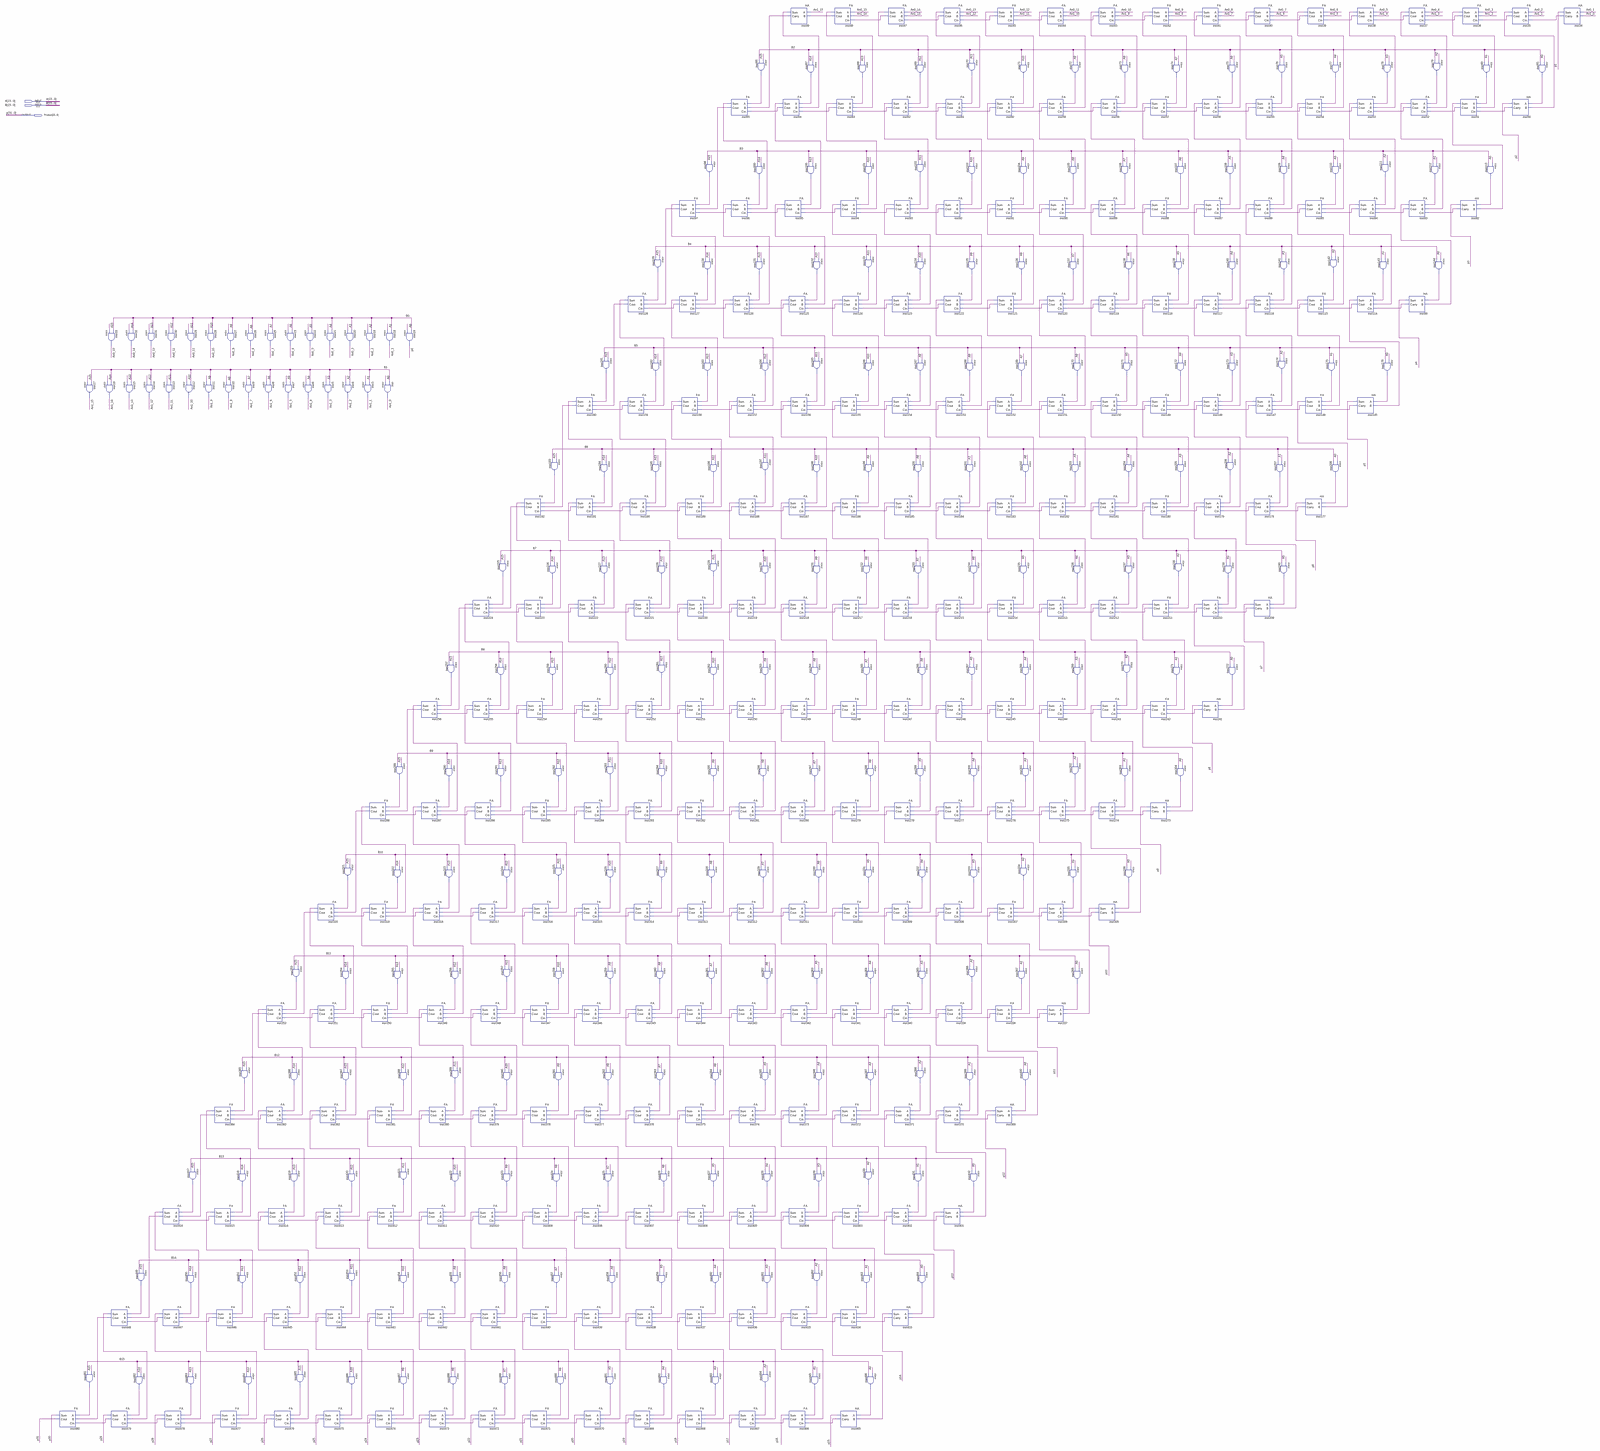
[diagram p0: schematic sheet, whole]
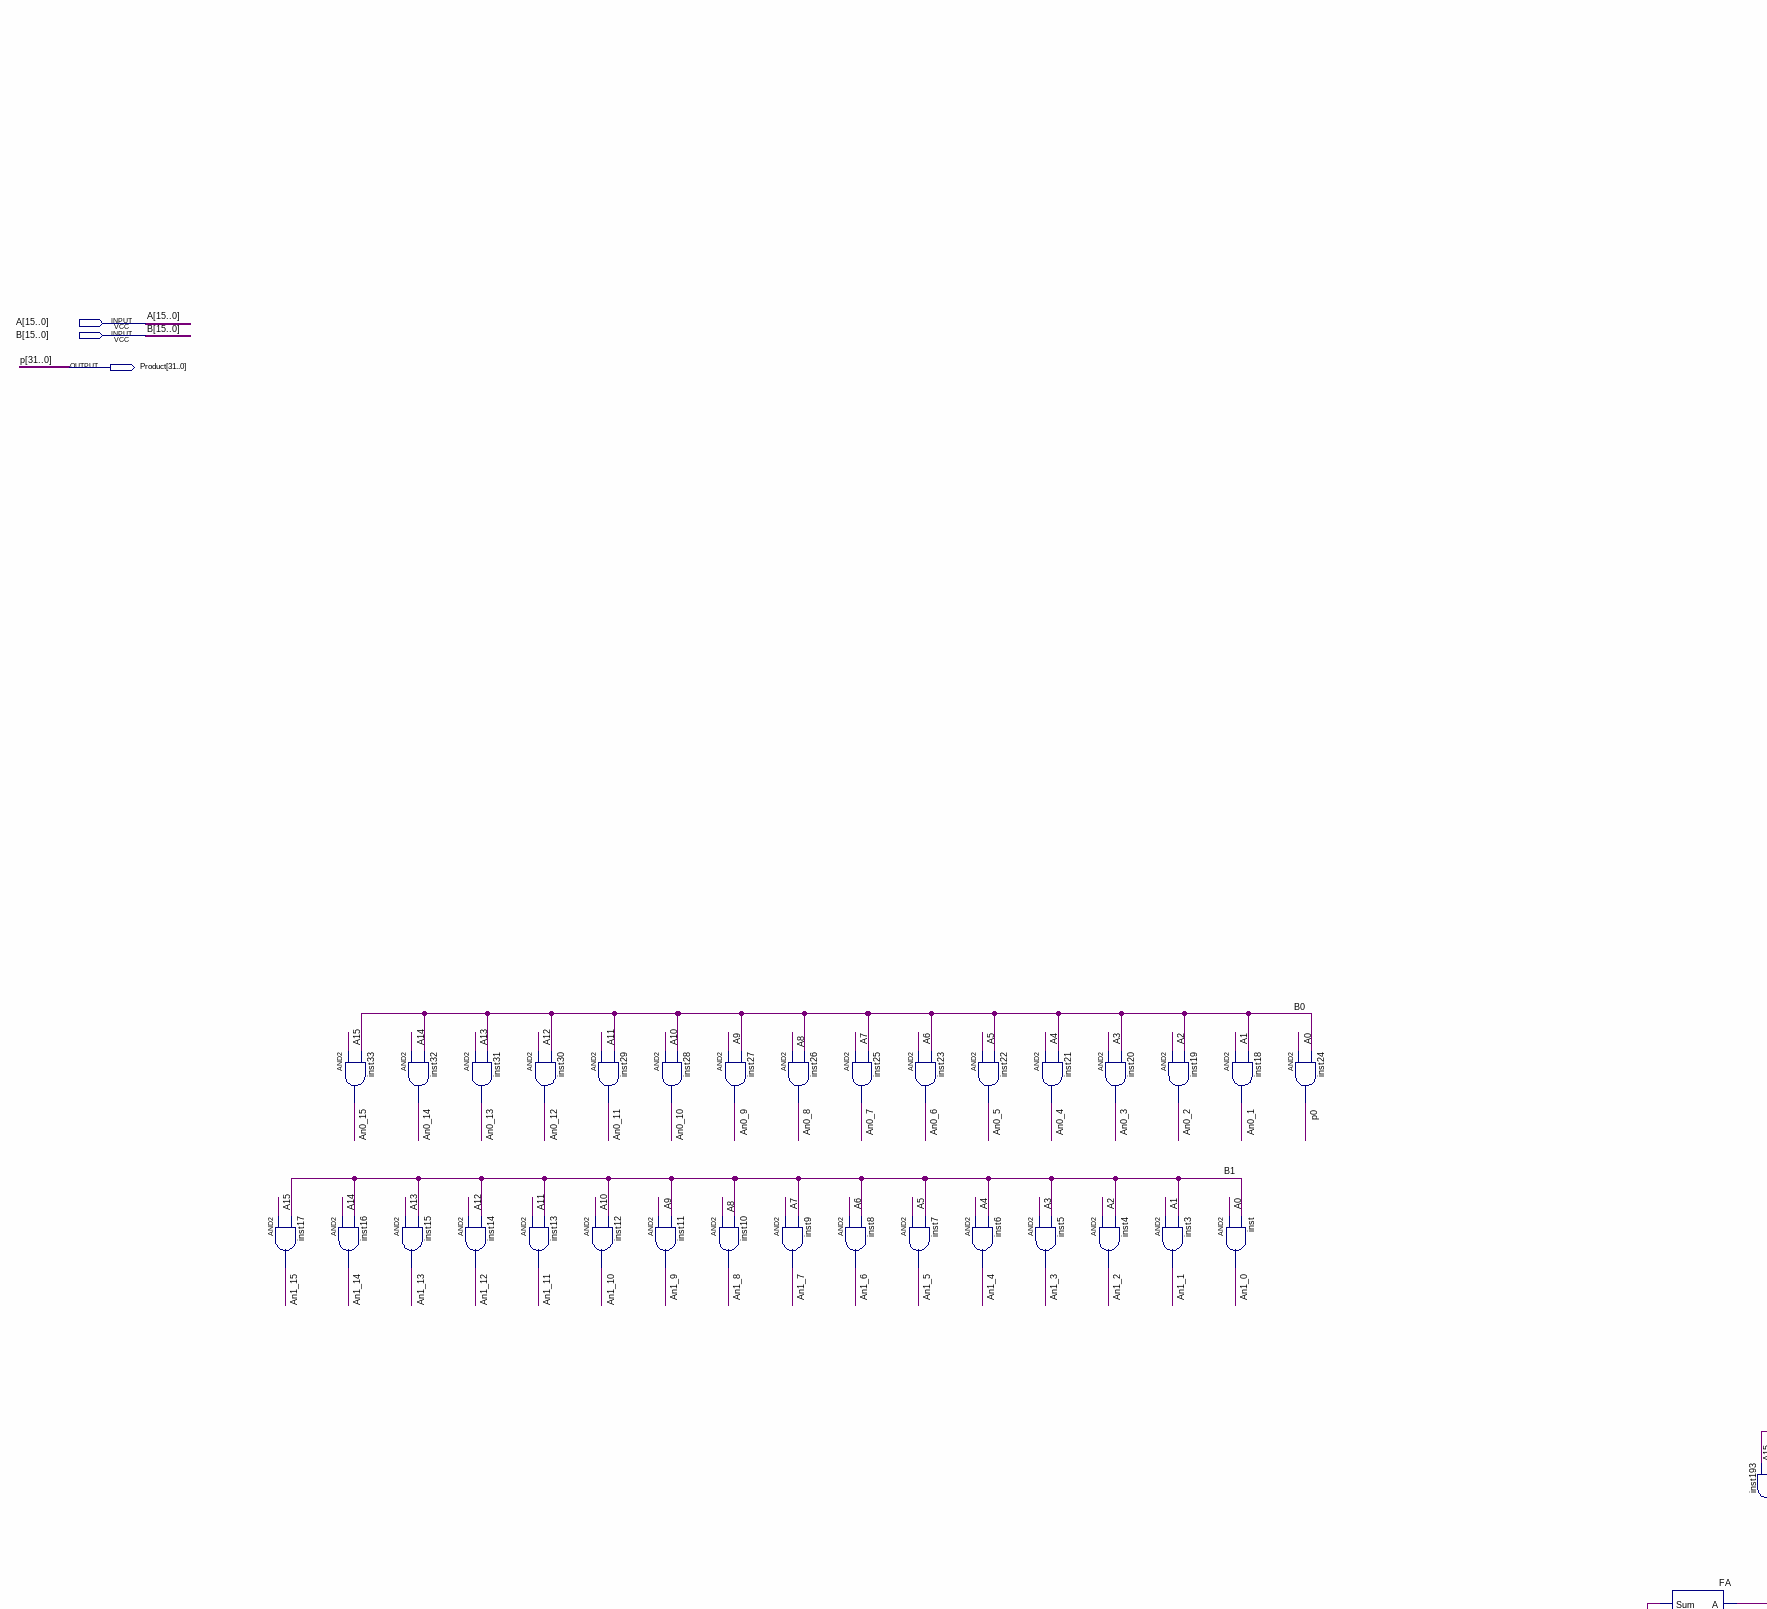
[diagram p1: schematic sheet, upper left part]
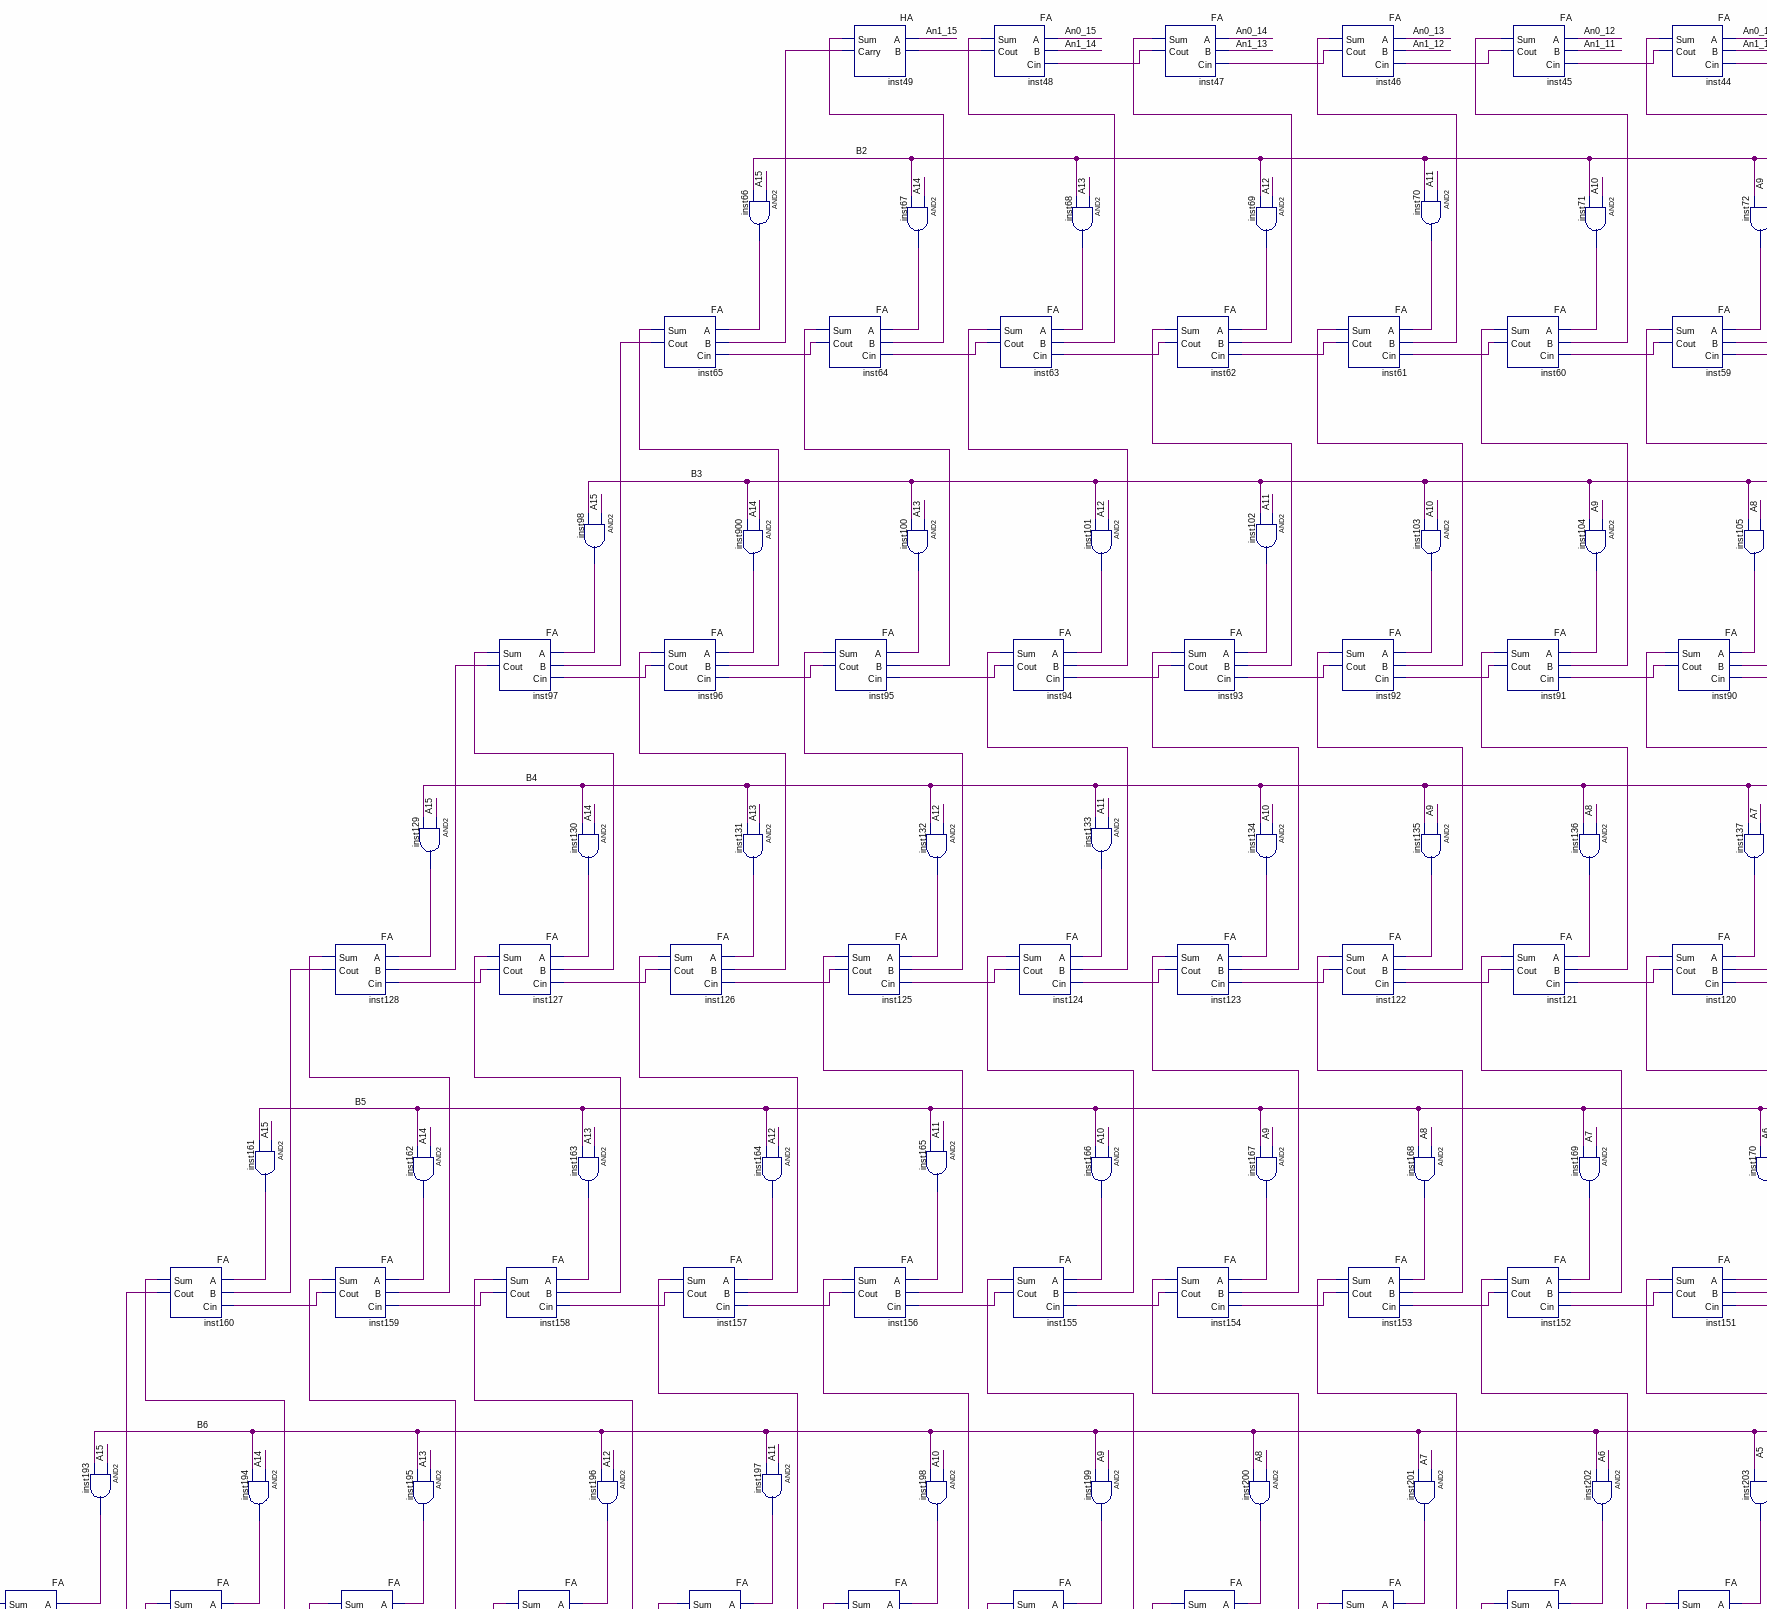
[diagram p2: schematic sheet, upper centre part]
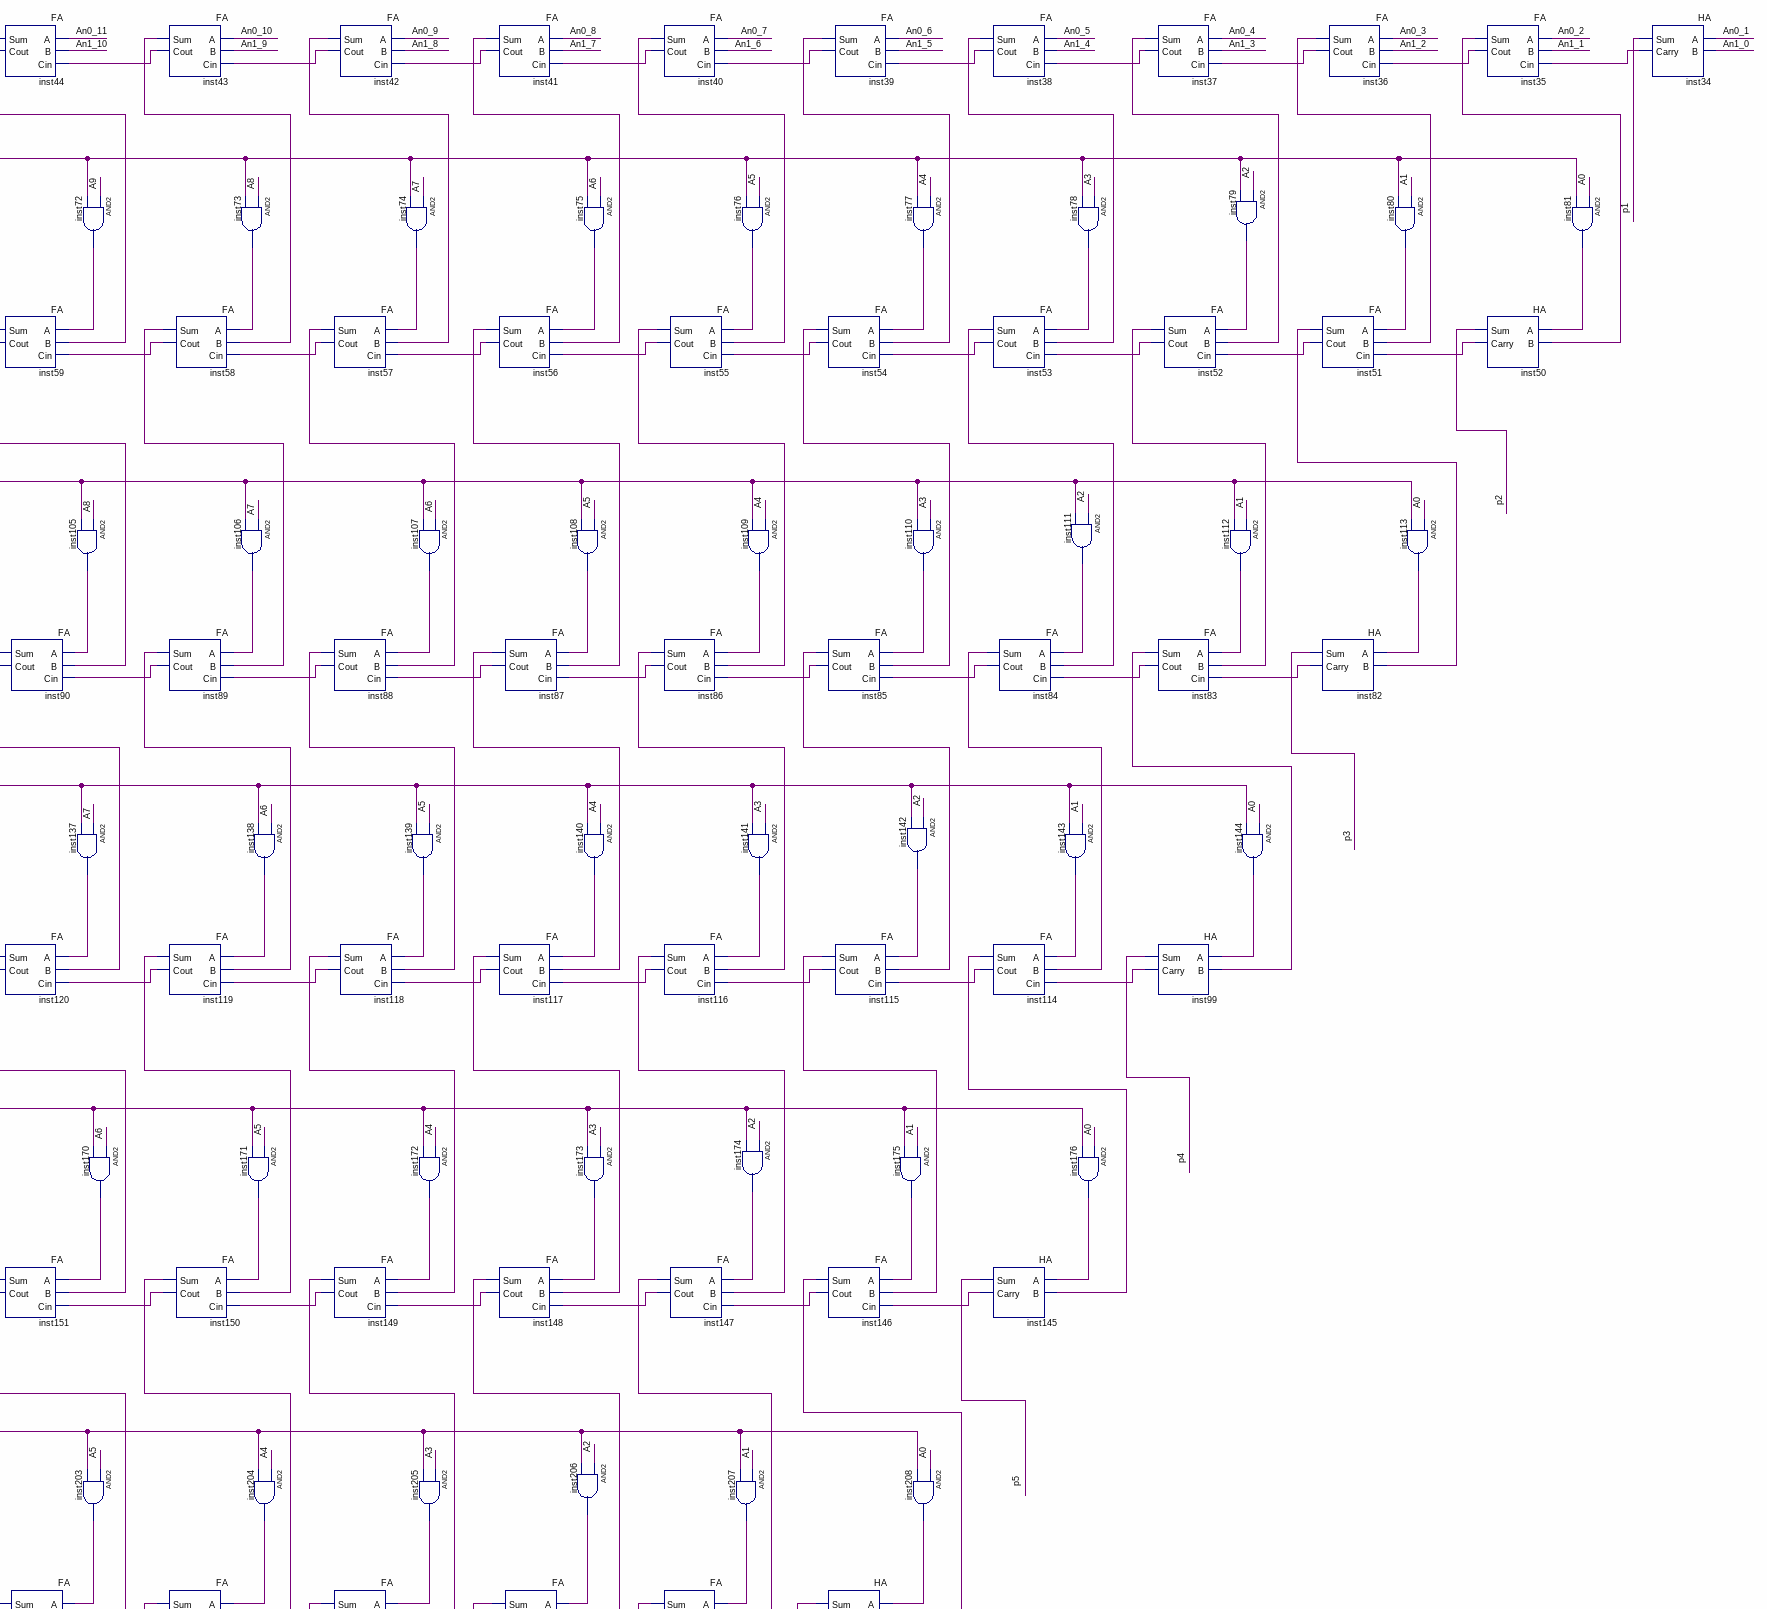
[diagram p3: schematic sheet, upper right part]
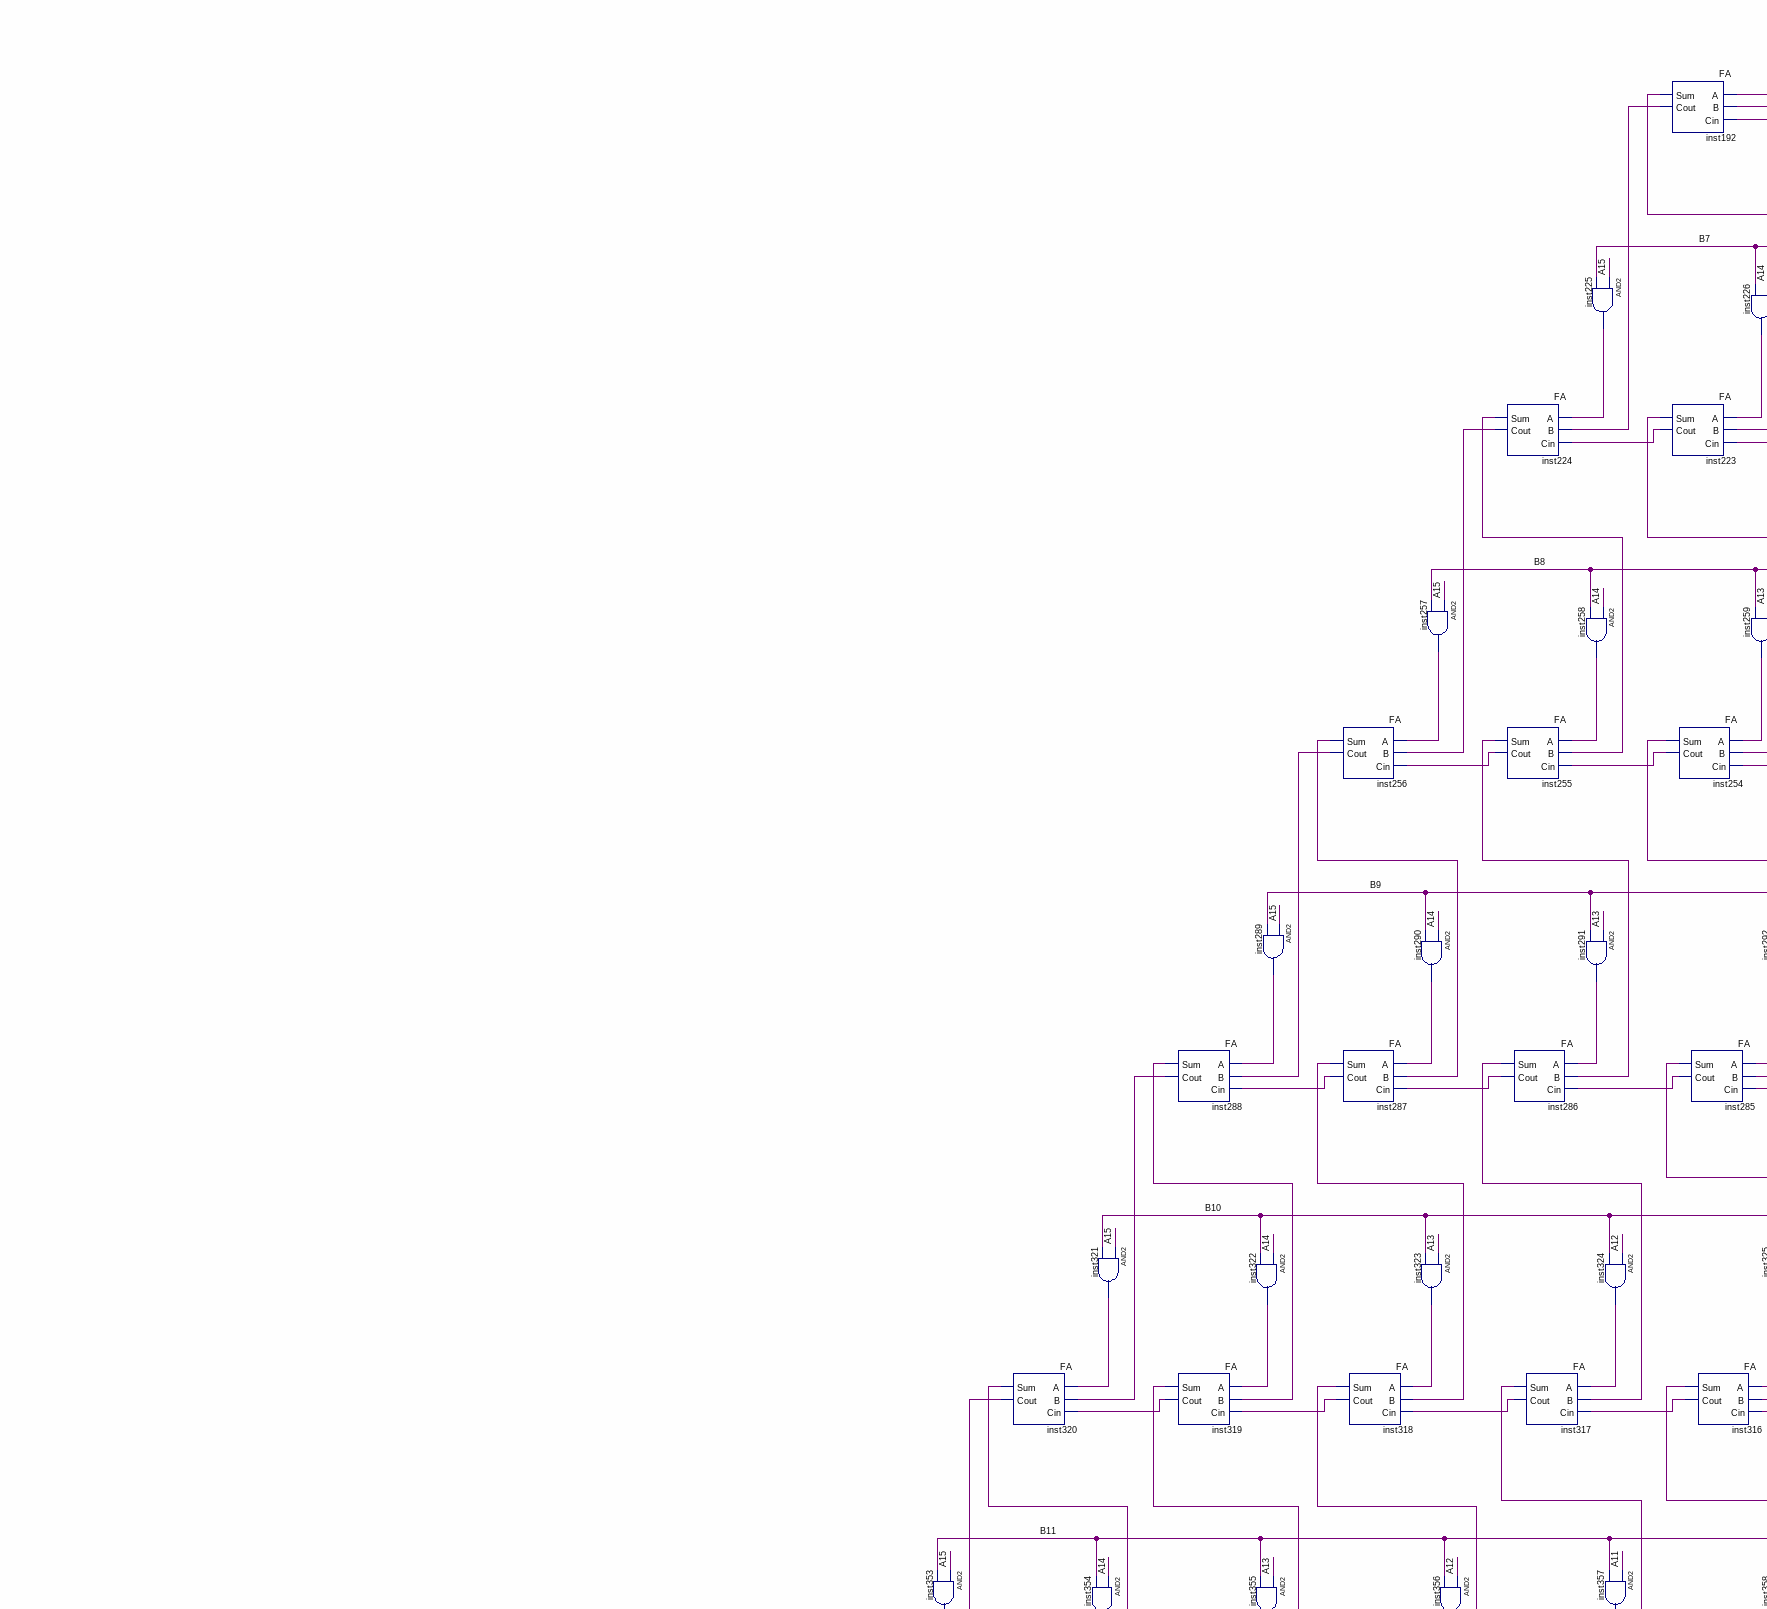
[diagram p4: schematic sheet, middle left part]
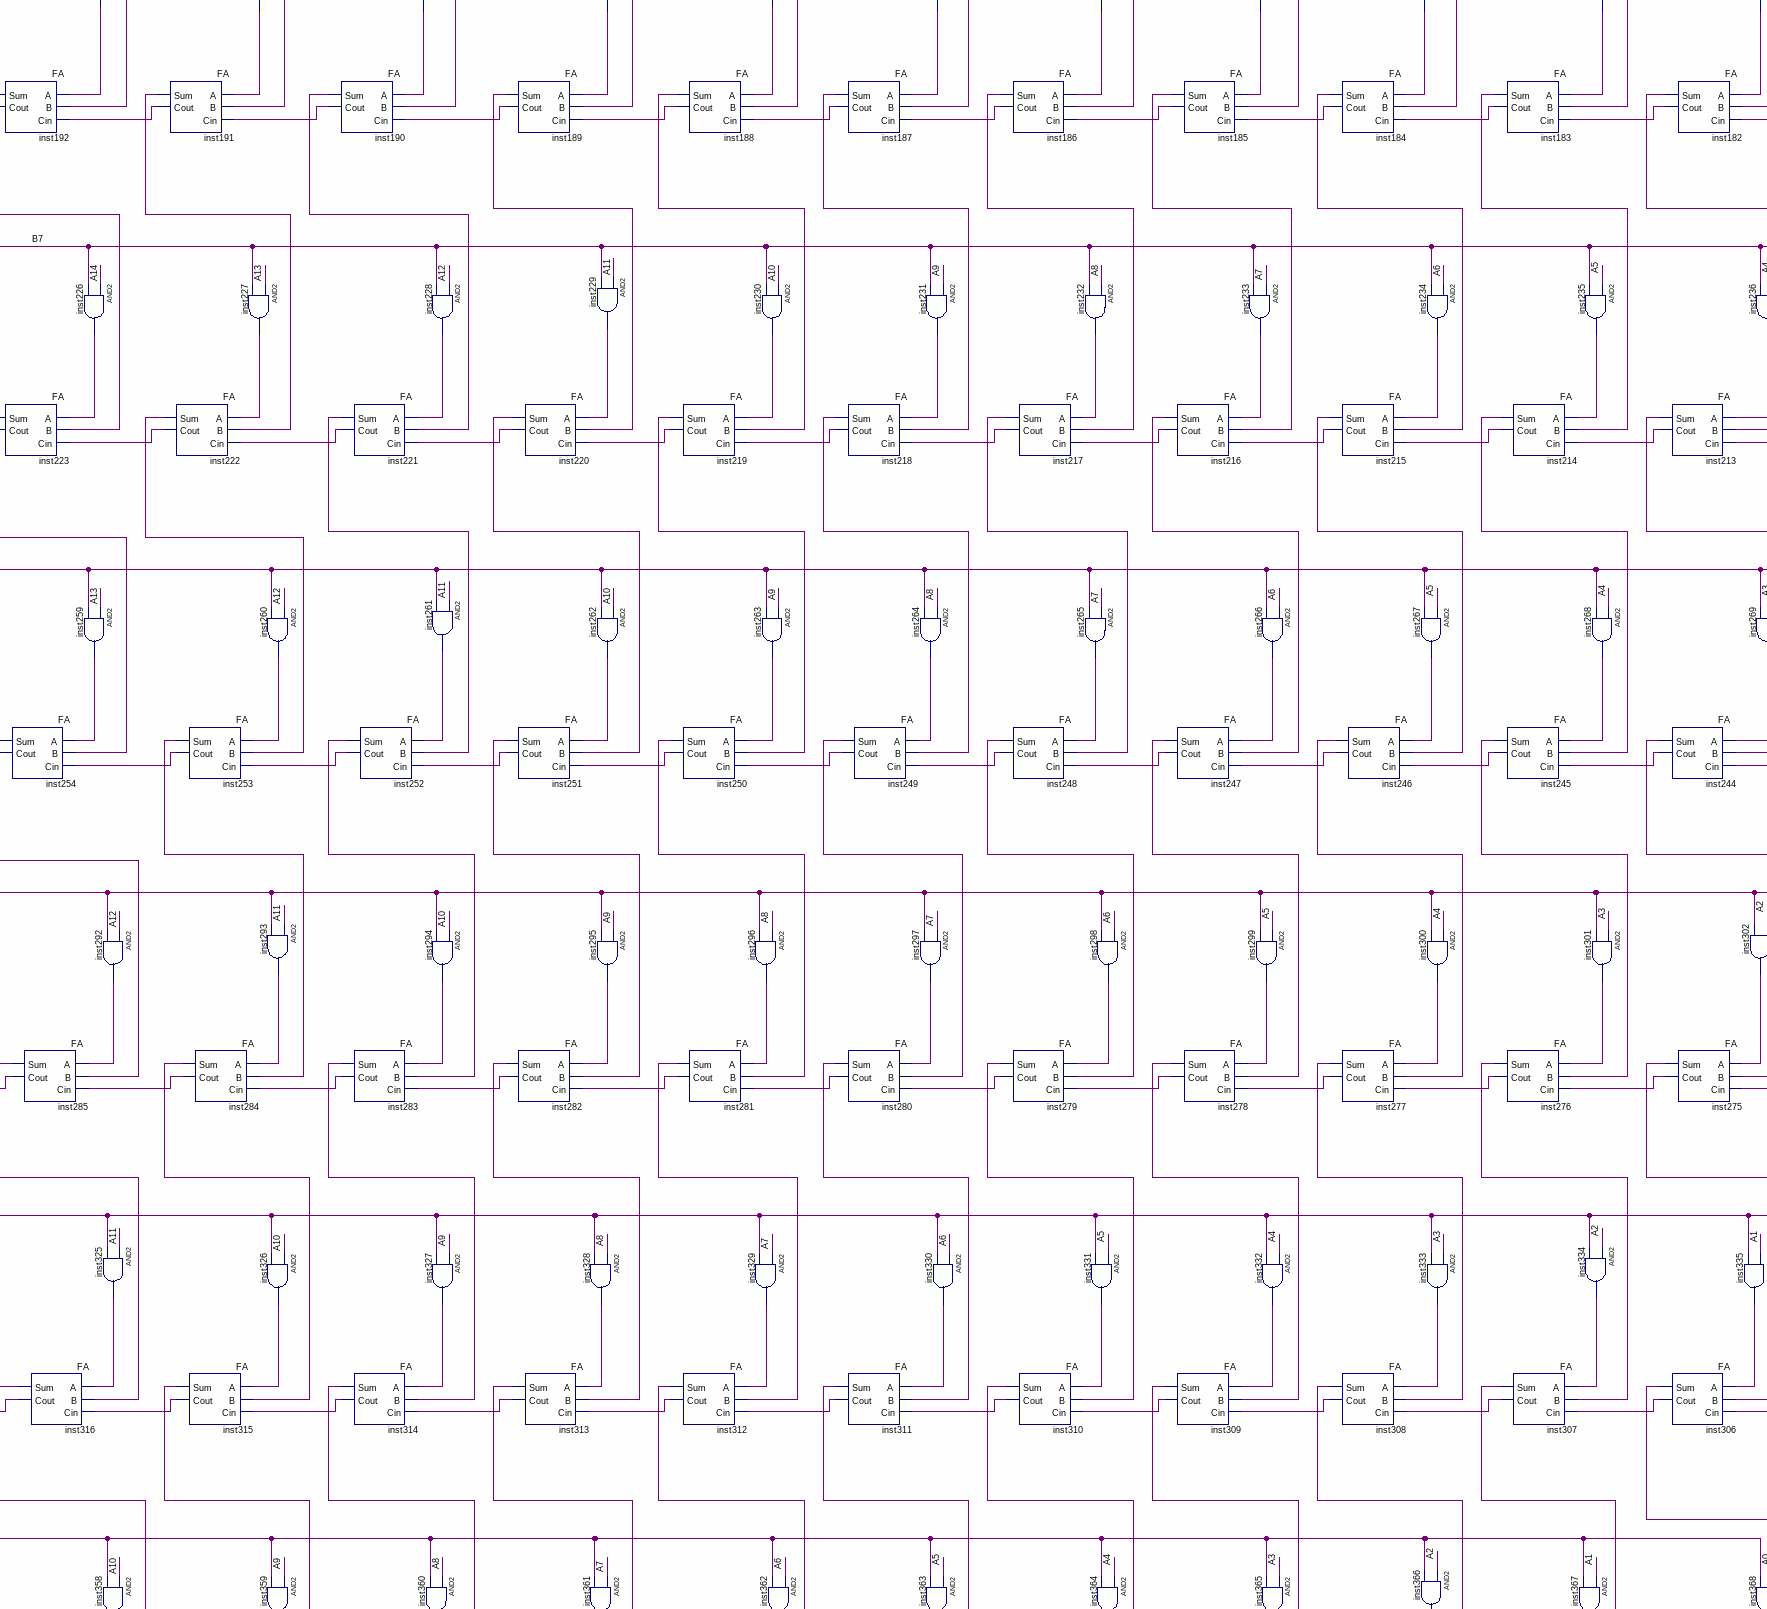
[diagram p5: schematic sheet, middle centre part]
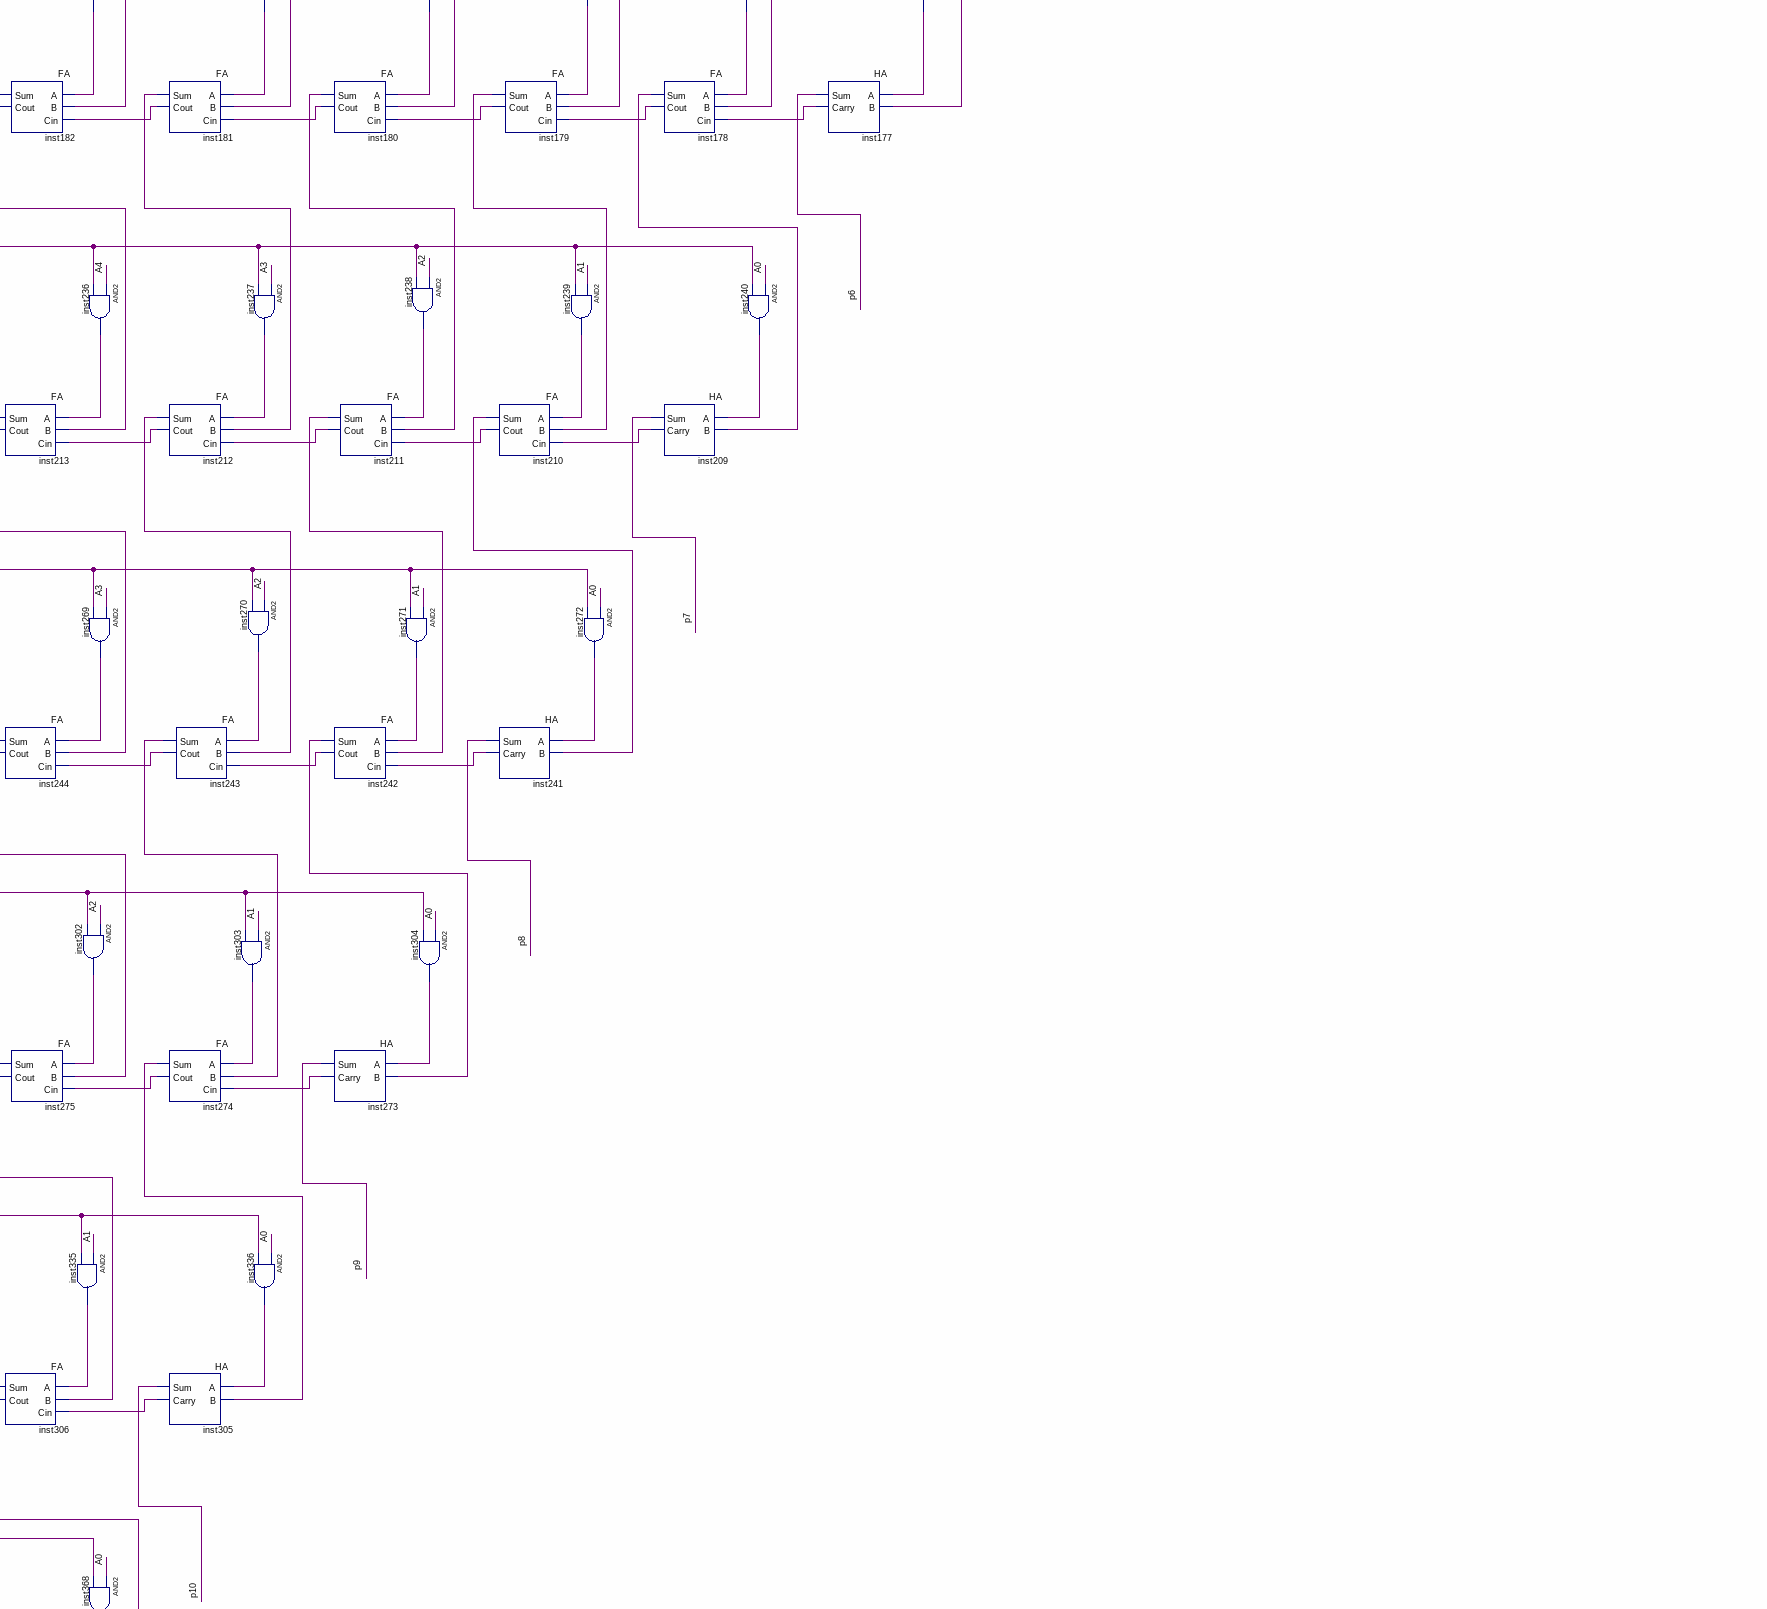
[diagram p6: schematic sheet, middle right part]
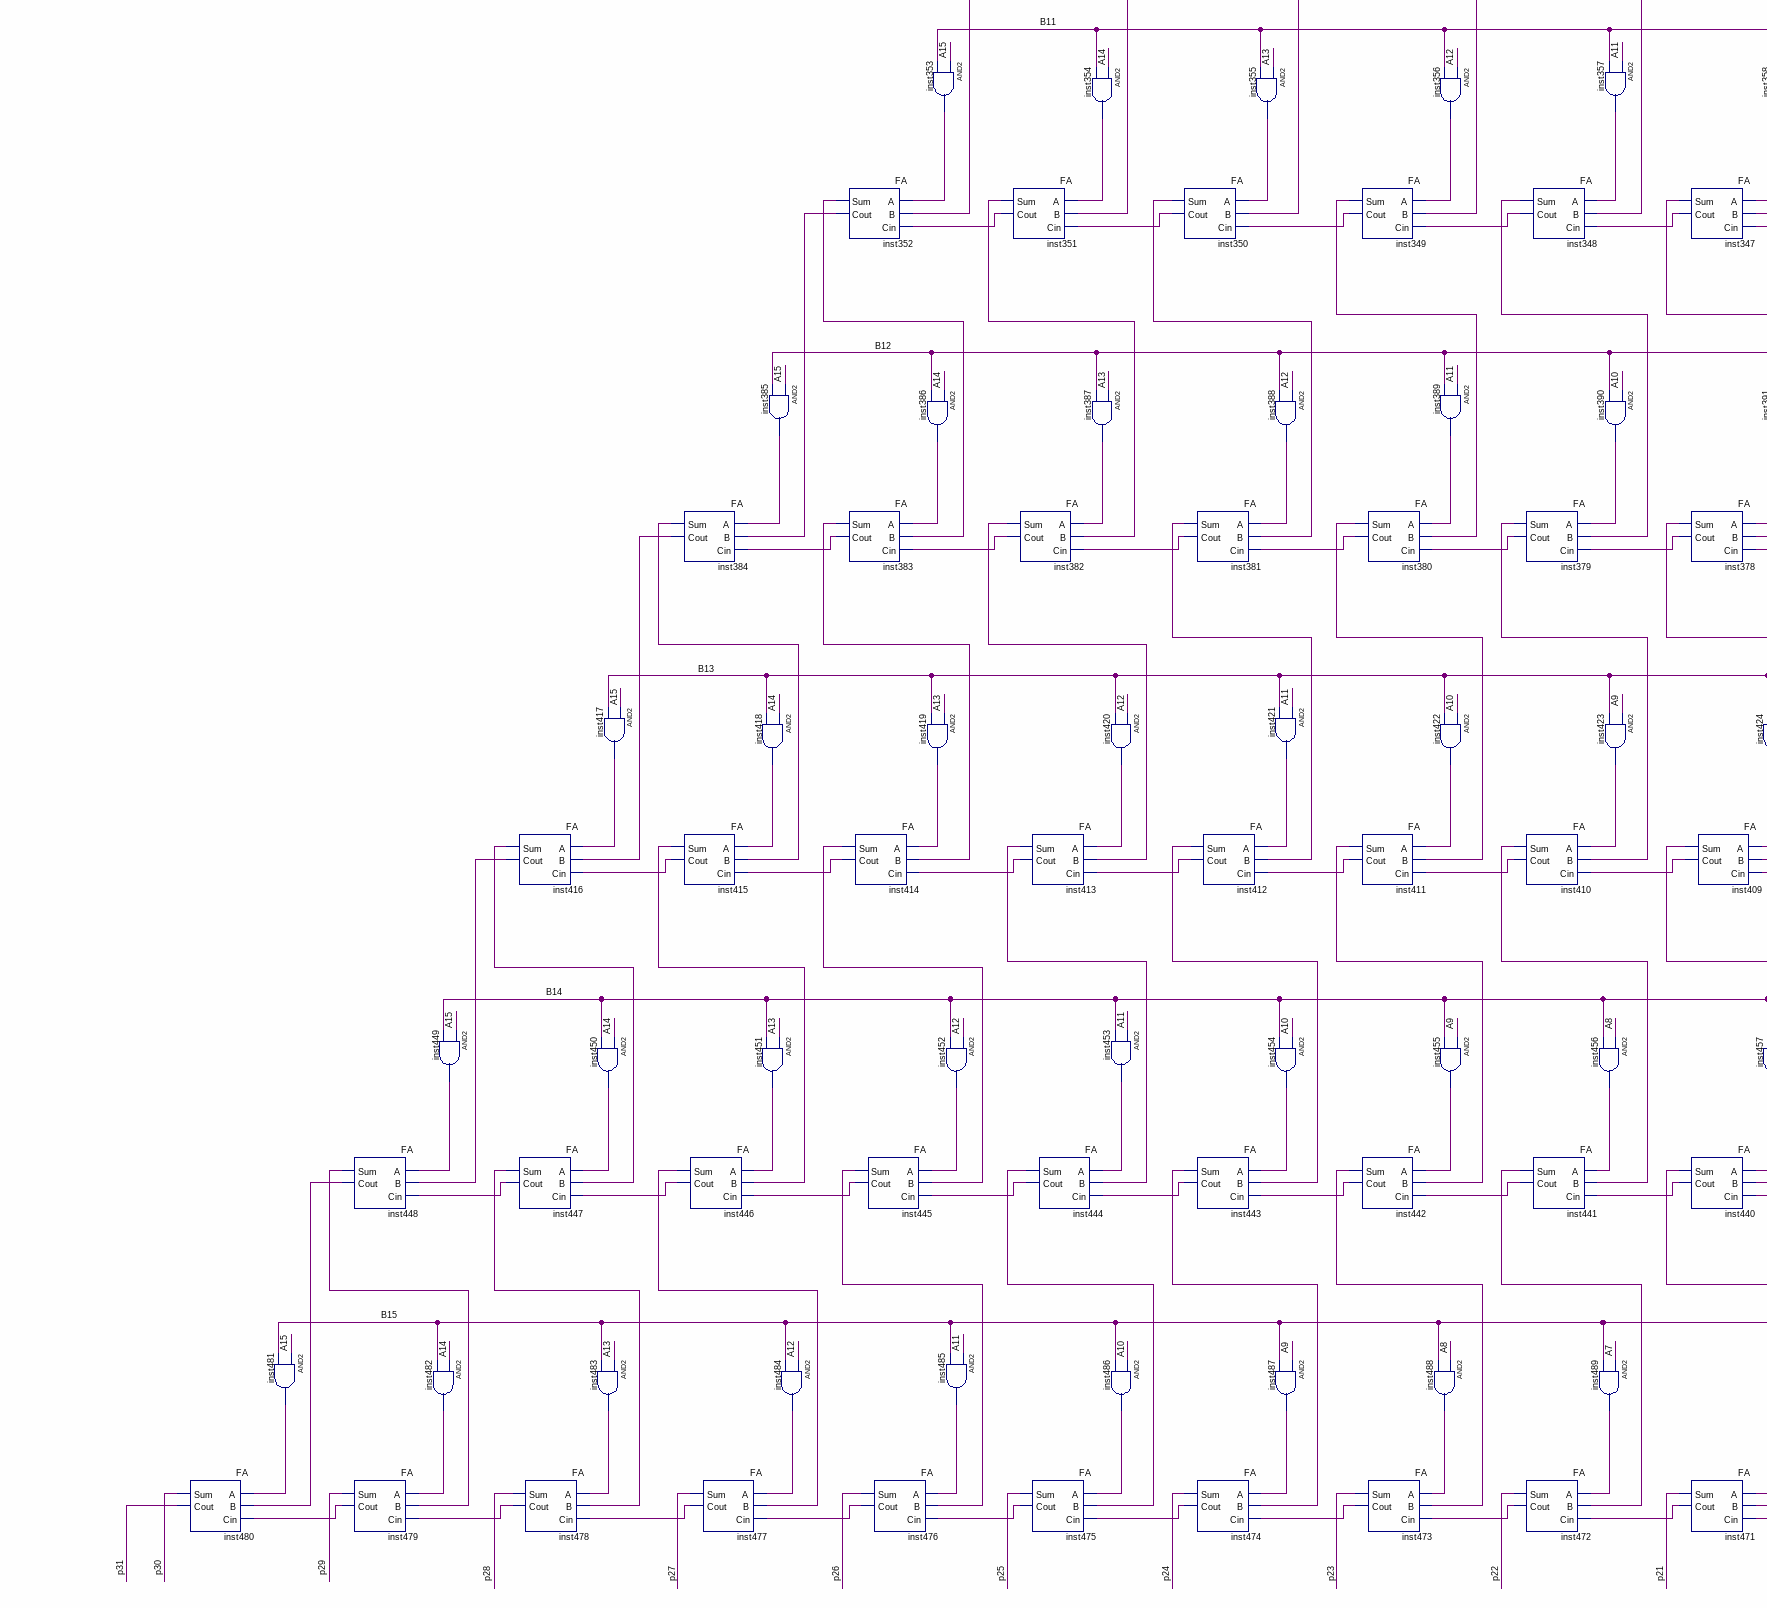
[diagram p7: schematic sheet, lower left part]
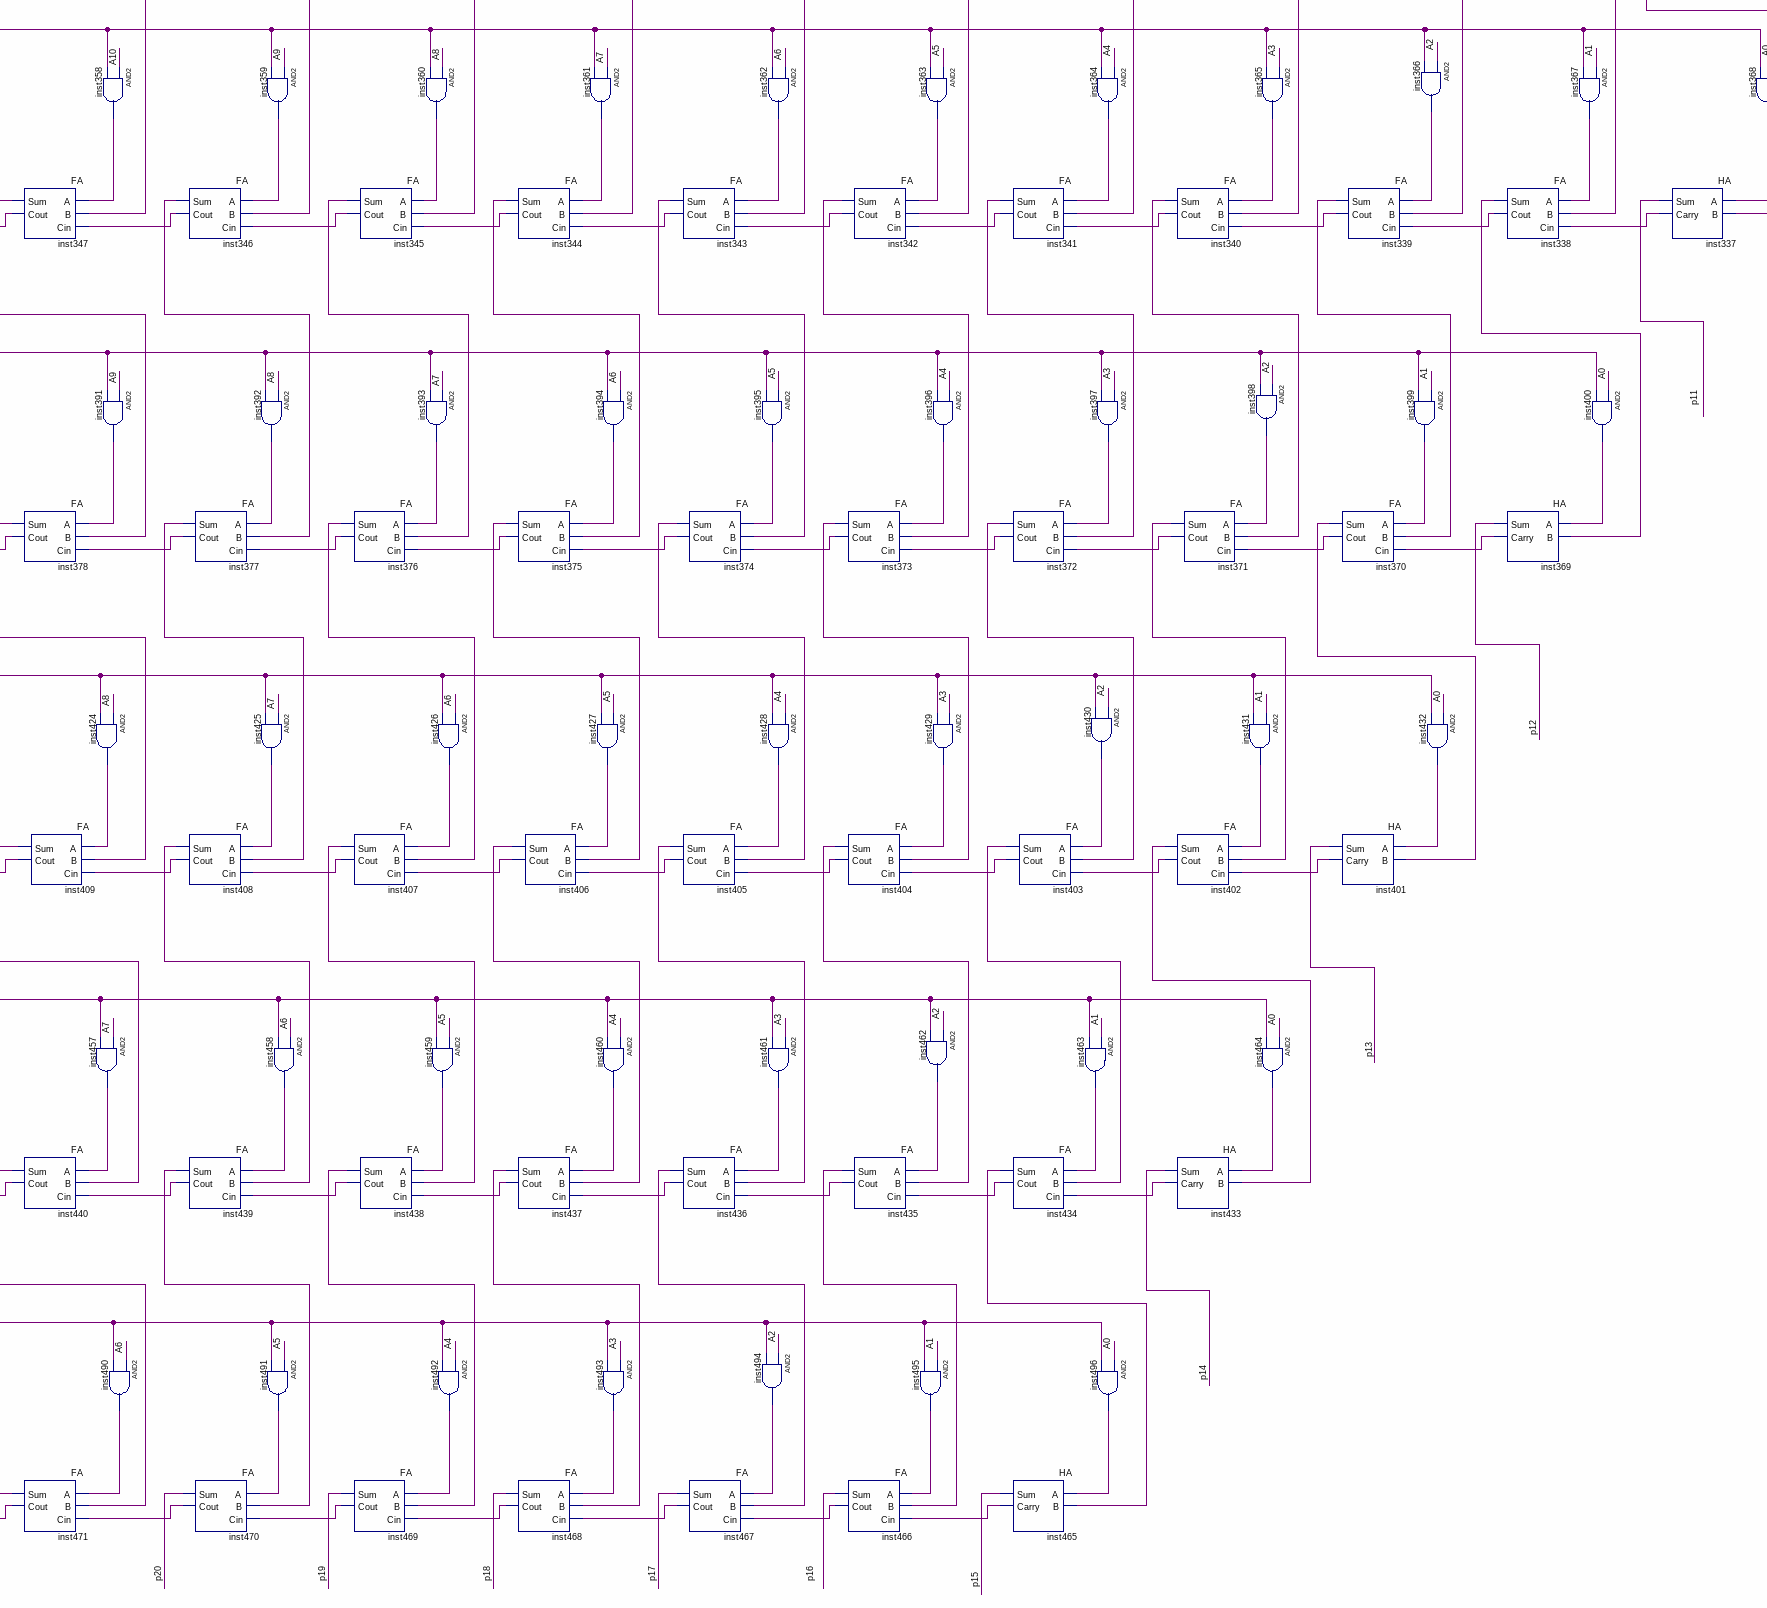
[diagram p8: schematic sheet, lower centre part]
// Quartus schematic Mul.bdf as structural Verilog: 496 symbols, 3 pins
module Mul (
  input  [15:0] A,
  input  [15:0] B,
  output [31:0] Product
);

  wire An0_1, An0_2, An0_3, An0_4, An0_5, An0_6, An0_7, An0_8, An0_9, An0_10, An0_11, An0_12, An0_13, An0_14,
       An0_15, An1_0, An1_1, An1_2, An1_3, An1_4, An1_5, An1_6, An1_7, An1_8, An1_9, An1_10, An1_11, An1_12,
       An1_13, An1_14, An1_15, inst34_carry, inst35_cout, inst35_sum, inst36_cout, inst36_sum, inst37_cout,
       inst37_sum, inst38_cout, inst38_sum, inst39_cout, inst39_sum, inst40_cout, inst40_sum, inst41_cout,
       inst41_sum, inst42_cout, inst42_sum, inst43_cout, inst43_sum, inst44_cout, inst44_sum, inst45_cout,
       inst45_sum, inst46_cout, inst46_sum, inst47_cout, inst47_sum, inst48_cout, inst48_sum, inst49_carry,
       inst49_sum, inst50_carry, inst51_cout, inst51_sum, inst52_cout, inst52_sum, inst53_cout, inst53_sum,
       inst54_cout, inst54_sum, inst55_cout, inst55_sum, inst56_cout, inst56_sum, inst57_cout, inst57_sum,
       inst58_cout, inst58_sum, inst59_cout, inst59_sum, inst60_cout, inst60_sum, inst61_cout, inst61_sum,
       inst62_cout, inst62_sum, inst63_cout, inst63_sum, inst64_cout, inst64_sum, inst65_cout, inst65_sum,
       inst66_out, inst67_out, inst68_out, inst69_out, inst70_out, inst71_out, inst72_out, inst73_out,
       inst74_out, inst75_out, inst76_out, inst77_out, inst78_out, inst79_out, inst80_out, inst81_out,
       inst82_carry, inst83_cout, inst83_sum, inst84_cout, inst84_sum, inst85_cout, inst85_sum, inst86_cout,
       inst86_sum, inst87_cout, inst87_sum, inst88_cout, inst88_sum, inst89_cout, inst89_sum, inst90_cout,
       inst90_sum, inst91_cout, inst91_sum, inst92_cout, inst92_sum, inst93_cout, inst93_sum, inst94_cout,
       inst94_sum, inst95_cout, inst95_sum, inst96_cout, inst96_sum, inst97_cout, inst97_sum, inst98_out,
       inst99_carry, inst100_out, inst101_out, inst102_out, inst103_out, inst104_out, inst105_out,
       inst106_out, inst107_out, inst108_out, inst109_out, inst110_out, inst111_out, inst112_out,
       inst113_out, inst114_cout, inst114_sum, inst115_cout, inst115_sum, inst116_cout, inst116_sum,
       inst117_cout, inst117_sum, inst118_cout, inst118_sum, inst119_cout, inst119_sum, inst120_cout,
       inst120_sum, inst121_cout, inst121_sum, inst122_cout, inst122_sum, inst123_cout, inst123_sum,
       inst124_cout, inst124_sum, inst125_cout, inst125_sum, inst126_cout, inst126_sum, inst127_cout,
       inst127_sum, inst128_cout, inst128_sum, inst129_out, inst130_out, inst131_out, inst132_out,
       inst133_out, inst134_out, inst135_out, inst136_out, inst137_out, inst138_out, inst139_out,
       inst140_out, inst141_out, inst142_out, inst143_out, inst144_out, inst145_carry, inst146_cout,
       inst146_sum, inst147_cout, inst147_sum, inst148_cout, inst148_sum, inst149_cout, inst149_sum,
       inst150_cout, inst150_sum, inst151_cout, inst151_sum, inst152_cout, inst152_sum, inst153_cout,
       inst153_sum, inst154_cout, inst154_sum, inst155_cout, inst155_sum, inst156_cout, inst156_sum,
       inst157_cout, inst157_sum, inst158_cout, inst158_sum, inst159_cout, inst159_sum, inst160_cout,
       inst160_sum, inst161_out, inst162_out, inst163_out, inst164_out, inst165_out, inst166_out,
       inst167_out, inst168_out, inst169_out, inst170_out, inst171_out, inst172_out, inst173_out,
       inst174_out, inst175_out, inst176_out, inst177_carry, inst178_cout, inst178_sum, inst179_cout,
       inst179_sum, inst180_cout, inst180_sum, inst181_cout, inst181_sum, inst182_cout, inst182_sum,
       inst183_cout, inst183_sum, inst184_cout, inst184_sum, inst185_cout, inst185_sum, inst186_cout,
       inst186_sum, inst187_cout, inst187_sum, inst188_cout, inst188_sum, inst189_cout, inst189_sum,
       inst190_cout, inst190_sum, inst191_cout, inst191_sum, inst192_cout, inst192_sum, inst193_out,
       inst194_out, inst195_out, inst196_out, inst197_out, inst198_out, inst199_out, inst200_out,
       inst201_out, inst202_out, inst203_out, inst204_out, inst205_out, inst206_out, inst207_out,
       inst208_out, inst209_carry, inst210_cout, inst210_sum, inst211_cout, inst211_sum, inst212_cout,
       inst212_sum, inst213_cout, inst213_sum, inst214_cout, inst214_sum, inst215_cout, inst215_sum,
       inst216_cout, inst216_sum, inst217_cout, inst217_sum, inst218_cout, inst218_sum, inst219_cout,
       inst219_sum, inst220_cout, inst220_sum, inst221_cout, inst221_sum, inst222_cout, inst222_sum,
       inst223_cout, inst223_sum, inst224_cout, inst224_sum, inst225_out, inst226_out, inst227_out,
       inst228_out, inst229_out, inst230_out, inst231_out, inst232_out, inst233_out, inst234_out,
       inst235_out, inst236_out, inst237_out, inst238_out, inst239_out, inst240_out, inst241_carry,
       inst242_cout, inst242_sum, inst243_cout, inst243_sum, inst244_cout, inst244_sum, inst245_cout,
       inst245_sum, inst246_cout, inst246_sum, inst247_cout, inst247_sum, inst248_cout, inst248_sum,
       inst249_cout, inst249_sum, inst250_cout, inst250_sum, inst251_cout, inst251_sum, inst252_cout,
       inst252_sum, inst253_cout, inst253_sum, inst254_cout, inst254_sum, inst255_cout, inst255_sum,
       inst256_cout, inst256_sum, inst257_out, inst258_out, inst259_out, inst260_out, inst261_out,
       inst262_out, inst263_out, inst264_out, inst265_out, inst266_out, inst267_out, inst268_out,
       inst269_out, inst270_out, inst271_out, inst272_out, inst273_carry, inst274_cout, inst274_sum,
       inst275_cout, inst275_sum, inst276_cout, inst276_sum, inst277_cout, inst277_sum, inst278_cout,
       inst278_sum, inst279_cout, inst279_sum, inst280_cout, inst280_sum, inst281_cout, inst281_sum,
       inst282_cout, inst282_sum, inst283_cout, inst283_sum, inst284_cout, inst284_sum, inst285_cout,
       inst285_sum, inst286_cout, inst286_sum, inst287_cout, inst287_sum, inst288_cout, inst288_sum,
       inst289_out, inst290_out, inst291_out, inst292_out, inst293_out, inst294_out, inst295_out,
       inst296_out, inst297_out, inst298_out, inst299_out, inst300_out, inst301_out, inst302_out,
       inst303_out, inst304_out, inst305_carry, inst306_cout, inst306_sum, inst307_cout, inst307_sum,
       inst308_cout, inst308_sum, inst309_cout, inst309_sum, inst310_cout, inst310_sum, inst311_cout,
       inst311_sum, inst312_cout, inst312_sum, inst313_cout, inst313_sum, inst314_cout, inst314_sum,
       inst315_cout, inst315_sum, inst316_cout, inst316_sum, inst317_cout, inst317_sum, inst318_cout,
       inst318_sum, inst319_cout, inst319_sum, inst320_cout, inst320_sum, inst321_out, inst322_out,
       inst323_out, inst324_out, inst325_out, inst326_out, inst327_out, inst328_out, inst329_out,
       inst330_out, inst331_out, inst332_out, inst333_out, inst334_out, inst335_out, inst336_out,
       inst337_carry, inst338_cout, inst338_sum, inst339_cout, inst339_sum, inst340_cout, inst340_sum,
       inst341_cout, inst341_sum, inst342_cout, inst342_sum, inst343_cout, inst343_sum, inst344_cout,
       inst344_sum, inst345_cout, inst345_sum, inst346_cout, inst346_sum, inst347_cout, inst347_sum,
       inst348_cout, inst348_sum, inst349_cout, inst349_sum, inst350_cout, inst350_sum, inst351_cout,
       inst351_sum, inst352_cout, inst352_sum, inst353_out, inst354_out, inst355_out, inst356_out,
       inst357_out, inst358_out, inst359_out, inst360_out, inst361_out, inst362_out, inst363_out,
       inst364_out, inst365_out, inst366_out, inst367_out, inst368_out, inst369_carry, inst370_cout,
       inst370_sum, inst371_cout, inst371_sum, inst372_cout, inst372_sum, inst373_cout, inst373_sum,
       inst374_cout, inst374_sum, inst375_cout, inst375_sum, inst376_cout, inst376_sum, inst377_cout,
       inst377_sum, inst378_cout, inst378_sum, inst379_cout, inst379_sum, inst380_cout, inst380_sum,
       inst381_cout, inst381_sum, inst382_cout, inst382_sum, inst383_cout, inst383_sum, inst384_cout,
       inst384_sum, inst385_out, inst386_out, inst387_out, inst388_out, inst389_out, inst390_out,
       inst391_out, inst392_out, inst393_out, inst394_out, inst395_out, inst396_out, inst397_out,
       inst398_out, inst399_out, inst400_out, inst401_carry, inst402_cout, inst402_sum, inst403_cout,
       inst403_sum, inst404_cout, inst404_sum, inst405_cout, inst405_sum, inst406_cout, inst406_sum,
       inst407_cout, inst407_sum, inst408_cout, inst408_sum, inst409_cout, inst409_sum, inst410_cout,
       inst410_sum, inst411_cout, inst411_sum, inst412_cout, inst412_sum, inst413_cout, inst413_sum,
       inst414_cout, inst414_sum, inst415_cout, inst415_sum, inst416_cout, inst416_sum, inst417_out,
       inst418_out, inst419_out, inst420_out, inst421_out, inst422_out, inst423_out, inst424_out,
       inst425_out, inst426_out, inst427_out, inst428_out, inst429_out, inst430_out, inst431_out,
       inst432_out, inst433_carry, inst434_cout, inst434_sum, inst435_cout, inst435_sum, inst436_cout,
       inst436_sum, inst437_cout, inst437_sum, inst438_cout, inst438_sum, inst439_cout, inst439_sum,
       inst440_cout, inst440_sum, inst441_cout, inst441_sum, inst442_cout, inst442_sum, inst443_cout,
       inst443_sum, inst444_cout, inst444_sum, inst445_cout, inst445_sum, inst446_cout, inst446_sum,
       inst447_cout, inst447_sum, inst448_cout, inst448_sum, inst449_out, inst450_out, inst451_out,
       inst452_out, inst453_out, inst454_out, inst455_out, inst456_out, inst457_out, inst458_out,
       inst459_out, inst460_out, inst461_out, inst462_out, inst463_out, inst464_out, inst465_carry,
       inst466_cout, inst467_cout, inst468_cout, inst469_cout, inst470_cout, inst471_cout, inst472_cout,
       inst473_cout, inst474_cout, inst475_cout, inst476_cout, inst477_cout, inst478_cout, inst479_cout,
       inst481_out, inst482_out, inst483_out, inst484_out, inst485_out, inst486_out, inst487_out,
       inst488_out, inst489_out, inst490_out, inst491_out, inst492_out, inst493_out, inst494_out,
       inst495_out, inst496_out, inst900_out;

  FA inst480 (.A(inst481_out), .B(inst448_cout), .Cin(inst479_cout), .Sum(Product[30]), .Cout(Product[31]));
  and inst17 (An1_15, A[15], B[1]);
  and inst481 (inst481_out, A[15], B[15]);
  and inst33 (An0_15, A[15], B[0]);
  and inst16 (An1_14, A[14], B[1]);
  FA inst448 (.A(inst449_out), .B(inst416_cout), .Cin(inst447_cout), .Sum(inst448_sum), .Cout(inst448_cout));
  FA inst479 (.A(inst482_out), .B(inst448_sum), .Cin(inst478_cout), .Sum(Product[29]), .Cout(inst479_cout));
  and inst32 (An0_14, A[14], B[0]);
  and inst15 (An1_13, A[13], B[1]);
  and inst449 (inst449_out, A[15], B[14]);
  and inst482 (inst482_out, A[14], B[15]);
  and inst31 (An0_13, A[13], B[0]);
  and inst14 (An1_12, A[12], B[1]);
  and inst30 (An0_12, A[12], B[0]);
  and inst13 (An1_11, A[11], B[1]);
  FA inst416 (.A(inst417_out), .B(inst384_cout), .Cin(inst415_cout), .Sum(inst416_sum), .Cout(inst416_cout));
  FA inst447 (.A(inst450_out), .B(inst416_sum), .Cin(inst446_cout), .Sum(inst447_sum), .Cout(inst447_cout));
  FA inst478 (.A(inst483_out), .B(inst447_sum), .Cin(inst477_cout), .Sum(Product[28]), .Cout(inst478_cout));
  and inst29 (An0_11, A[11], B[0]);
  and inst12 (An1_10, A[10], B[1]);
  and inst417 (inst417_out, A[15], B[13]);
  and inst450 (inst450_out, A[14], B[14]);
  and inst483 (inst483_out, A[13], B[15]);
  and inst28 (An0_10, A[10], B[0]);
  and inst11 (An1_9, A[9], B[1]);
  FA inst384 (.A(inst385_out), .B(inst352_cout), .Cin(inst383_cout), .Sum(inst384_sum), .Cout(inst384_cout));
  FA inst415 (.A(inst418_out), .B(inst384_sum), .Cin(inst414_cout), .Sum(inst415_sum), .Cout(inst415_cout));
  FA inst446 (.A(inst451_out), .B(inst415_sum), .Cin(inst445_cout), .Sum(inst446_sum), .Cout(inst446_cout));
  FA inst477 (.A(inst484_out), .B(inst446_sum), .Cin(inst476_cout), .Sum(Product[27]), .Cout(inst477_cout));
  and inst27 (An0_9, A[9], B[0]);
  and inst10 (An1_8, A[8], B[1]);
  and inst418 (inst418_out, A[14], B[13]);
  and inst451 (inst451_out, A[13], B[14]);
  and inst26 (An0_8, A[8], B[0]);
  and inst9 (An1_7, A[7], B[1]);
  and inst385 (inst385_out, A[15], B[12]);
  and inst484 (inst484_out, A[12], B[15]);
  and inst25 (An0_7, A[7], B[0]);
  and inst8 (An1_6, A[6], B[1]);
  FA inst352 (.A(inst353_out), .B(inst320_cout), .Cin(inst351_cout), .Sum(inst352_sum), .Cout(inst352_cout));
  FA inst383 (.A(inst386_out), .B(inst352_sum), .Cin(inst382_cout), .Sum(inst383_sum), .Cout(inst383_cout));
  FA inst414 (.A(inst419_out), .B(inst383_sum), .Cin(inst413_cout), .Sum(inst414_sum), .Cout(inst414_cout));
  FA inst445 (.A(inst452_out), .B(inst414_sum), .Cin(inst444_cout), .Sum(inst445_sum), .Cout(inst445_cout));
  and inst23 (An0_6, A[6], B[0]);
  and inst7 (An1_5, A[5], B[1]);
  FA inst476 (.A(inst485_out), .B(inst445_sum), .Cin(inst475_cout), .Sum(Product[26]), .Cout(inst476_cout));
  and inst353 (inst353_out, A[15], B[11]);
  and inst386 (inst386_out, A[14], B[12]);
  and inst419 (inst419_out, A[13], B[13]);
  and inst452 (inst452_out, A[12], B[14]);
  and inst485 (inst485_out, A[11], B[15]);
  and inst22 (An0_5, A[5], B[0]);
  and inst6 (An1_4, A[4], B[1]);
  FA inst320 (.A(inst321_out), .B(inst288_cout), .Cin(inst319_cout), .Sum(inst320_sum), .Cout(inst320_cout));
  FA inst351 (.A(inst354_out), .B(inst320_sum), .Cin(inst350_cout), .Sum(inst351_sum), .Cout(inst351_cout));
  FA inst382 (.A(inst387_out), .B(inst351_sum), .Cin(inst381_cout), .Sum(inst382_sum), .Cout(inst382_cout));
  and inst21 (An0_4, A[4], B[0]);
  and inst5 (An1_3, A[3], B[1]);
  FA inst413 (.A(inst420_out), .B(inst382_sum), .Cin(inst412_cout), .Sum(inst413_sum), .Cout(inst413_cout));
  FA inst444 (.A(inst453_out), .B(inst413_sum), .Cin(inst443_cout), .Sum(inst444_sum), .Cout(inst444_cout));
  FA inst475 (.A(inst486_out), .B(inst444_sum), .Cin(inst474_cout), .Sum(Product[25]), .Cout(inst475_cout));
  and inst20 (An0_3, A[3], B[0]);
  and inst4 (An1_2, A[2], B[1]);
  and inst321 (inst321_out, A[15], B[10]);
  and inst354 (inst354_out, A[14], B[11]);
  and inst387 (inst387_out, A[13], B[12]);
  and inst420 (inst420_out, A[12], B[13]);
  and inst453 (inst453_out, A[11], B[14]);
  and inst486 (inst486_out, A[10], B[15]);
  and inst19 (An0_2, A[2], B[0]);
  and inst3 (An1_1, A[1], B[1]);
  FA inst288 (.A(inst289_out), .B(inst256_cout), .Cin(inst287_cout), .Sum(inst288_sum), .Cout(inst288_cout));
  FA inst319 (.A(inst322_out), .B(inst288_sum), .Cin(inst318_cout), .Sum(inst319_sum), .Cout(inst319_cout));
  FA inst350 (.A(inst355_out), .B(inst319_sum), .Cin(inst349_cout), .Sum(inst350_sum), .Cout(inst350_cout));
  FA inst381 (.A(inst388_out), .B(inst350_sum), .Cin(inst380_cout), .Sum(inst381_sum), .Cout(inst381_cout));
  FA inst412 (.A(inst421_out), .B(inst381_sum), .Cin(inst411_cout), .Sum(inst412_sum), .Cout(inst412_cout));
  FA inst443 (.A(inst454_out), .B(inst412_sum), .Cin(inst442_cout), .Sum(inst443_sum), .Cout(inst443_cout));
  FA inst474 (.A(inst487_out), .B(inst443_sum), .Cin(inst473_cout), .Sum(Product[24]), .Cout(inst474_cout));
  and inst18 (An0_1, A[1], B[0]);
  and inst (An1_0, A[0], B[1]);
  and inst289 (inst289_out, A[15], B[9]);
  and inst322 (inst322_out, A[14], B[10]);
  and inst355 (inst355_out, A[13], B[11]);
  and inst24 (Product[0], A[0], B[0]);
  and inst388 (inst388_out, A[12], B[12]);
  and inst421 (inst421_out, A[11], B[13]);
  and inst454 (inst454_out, A[10], B[14]);
  and inst487 (inst487_out, A[9], B[15]);
  FA inst256 (.A(inst257_out), .B(inst224_cout), .Cin(inst255_cout), .Sum(inst256_sum), .Cout(inst256_cout));
  FA inst287 (.A(inst290_out), .B(inst256_sum), .Cin(inst286_cout), .Sum(inst287_sum), .Cout(inst287_cout));
  FA inst318 (.A(inst323_out), .B(inst287_sum), .Cin(inst317_cout), .Sum(inst318_sum), .Cout(inst318_cout));
  FA inst349 (.A(inst356_out), .B(inst318_sum), .Cin(inst348_cout), .Sum(inst349_sum), .Cout(inst349_cout));
  FA inst380 (.A(inst389_out), .B(inst349_sum), .Cin(inst379_cout), .Sum(inst380_sum), .Cout(inst380_cout));
  FA inst411 (.A(inst422_out), .B(inst380_sum), .Cin(inst410_cout), .Sum(inst411_sum), .Cout(inst411_cout));
  FA inst442 (.A(inst455_out), .B(inst411_sum), .Cin(inst441_cout), .Sum(inst442_sum), .Cout(inst442_cout));
  FA inst473 (.A(inst488_out), .B(inst442_sum), .Cin(inst472_cout), .Sum(Product[23]), .Cout(inst473_cout));
  and inst290 (inst290_out, A[14], B[9]);
  and inst323 (inst323_out, A[13], B[10]);
  and inst257 (inst257_out, A[15], B[8]);
  and inst356 (inst356_out, A[12], B[11]);
  and inst389 (inst389_out, A[11], B[12]);
  and inst422 (inst422_out, A[10], B[13]);
  and inst455 (inst455_out, A[9], B[14]);
  and inst488 (inst488_out, A[8], B[15]);
  FA inst224 (.A(inst225_out), .B(inst192_cout), .Cin(inst223_cout), .Sum(inst224_sum), .Cout(inst224_cout));
  FA inst255 (.A(inst258_out), .B(inst224_sum), .Cin(inst254_cout), .Sum(inst255_sum), .Cout(inst255_cout));
  FA inst286 (.A(inst291_out), .B(inst255_sum), .Cin(inst285_cout), .Sum(inst286_sum), .Cout(inst286_cout));
  FA inst317 (.A(inst324_out), .B(inst286_sum), .Cin(inst316_cout), .Sum(inst317_sum), .Cout(inst317_cout));
  FA inst379 (.A(inst390_out), .B(inst348_sum), .Cin(inst378_cout), .Sum(inst379_sum), .Cout(inst379_cout));
  FA inst410 (.A(inst423_out), .B(inst379_sum), .Cin(inst409_cout), .Sum(inst410_sum), .Cout(inst410_cout));
  FA inst472 (.A(inst489_out), .B(inst441_sum), .Cin(inst471_cout), .Sum(Product[22]), .Cout(inst472_cout));
  FA inst348 (.A(inst357_out), .B(inst317_sum), .Cin(inst347_cout), .Sum(inst348_sum), .Cout(inst348_cout));
  FA inst441 (.A(inst456_out), .B(inst410_sum), .Cin(inst440_cout), .Sum(inst441_sum), .Cout(inst441_cout));
  and inst225 (inst225_out, A[15], B[7]);
  and inst258 (inst258_out, A[14], B[8]);
  and inst291 (inst291_out, A[13], B[9]);
  and inst324 (inst324_out, A[12], B[10]);
  and inst357 (inst357_out, A[11], B[11]);
  and inst390 (inst390_out, A[10], B[12]);
  and inst423 (inst423_out, A[9], B[13]);
  and inst456 (inst456_out, A[8], B[14]);
  and inst489 (inst489_out, A[7], B[15]);
  FA inst192 (.A(inst193_out), .B(inst160_cout), .Cin(inst191_cout), .Sum(inst192_sum), .Cout(inst192_cout));
  FA inst223 (.A(inst226_out), .B(inst192_sum), .Cin(inst222_cout), .Sum(inst223_sum), .Cout(inst223_cout));
  FA inst254 (.A(inst259_out), .B(inst223_sum), .Cin(inst253_cout), .Sum(inst254_sum), .Cout(inst254_cout));
  FA inst285 (.A(inst292_out), .B(inst254_sum), .Cin(inst284_cout), .Sum(inst285_sum), .Cout(inst285_cout));
  FA inst316 (.A(inst325_out), .B(inst285_sum), .Cin(inst315_cout), .Sum(inst316_sum), .Cout(inst316_cout));
  FA inst347 (.A(inst358_out), .B(inst316_sum), .Cin(inst346_cout), .Sum(inst347_sum), .Cout(inst347_cout));
  FA inst378 (.A(inst391_out), .B(inst347_sum), .Cin(inst377_cout), .Sum(inst378_sum), .Cout(inst378_cout));
  FA inst409 (.A(inst424_out), .B(inst378_sum), .Cin(inst408_cout), .Sum(inst409_sum), .Cout(inst409_cout));
  FA inst440 (.A(inst457_out), .B(inst409_sum), .Cin(inst439_cout), .Sum(inst440_sum), .Cout(inst440_cout));
  FA inst471 (.A(inst490_out), .B(inst440_sum), .Cin(inst470_cout), .Sum(Product[21]), .Cout(inst471_cout));
  and inst193 (inst193_out, A[15], B[6]);
  and inst226 (inst226_out, A[14], B[7]);
  and inst259 (inst259_out, A[13], B[8]);
  and inst292 (inst292_out, A[12], B[9]);
  and inst325 (inst325_out, A[11], B[10]);
  and inst358 (inst358_out, A[10], B[11]);
  and inst391 (inst391_out, A[9], B[12]);
  and inst424 (inst424_out, A[8], B[13]);
  and inst457 (inst457_out, A[7], B[14]);
  and inst490 (inst490_out, A[6], B[15]);
  FA inst160 (.A(inst161_out), .B(inst128_cout), .Cin(inst159_cout), .Sum(inst160_sum), .Cout(inst160_cout));
  FA inst191 (.A(inst194_out), .B(inst160_sum), .Cin(inst190_cout), .Sum(inst191_sum), .Cout(inst191_cout));
  FA inst222 (.A(inst227_out), .B(inst191_sum), .Cin(inst221_cout), .Sum(inst222_sum), .Cout(inst222_cout));
  FA inst253 (.A(inst260_out), .B(inst222_sum), .Cin(inst252_cout), .Sum(inst253_sum), .Cout(inst253_cout));
  FA inst284 (.A(inst293_out), .B(inst253_sum), .Cin(inst283_cout), .Sum(inst284_sum), .Cout(inst284_cout));
  FA inst315 (.A(inst326_out), .B(inst284_sum), .Cin(inst314_cout), .Sum(inst315_sum), .Cout(inst315_cout));
  FA inst346 (.A(inst359_out), .B(inst315_sum), .Cin(inst345_cout), .Sum(inst346_sum), .Cout(inst346_cout));
  FA inst377 (.A(inst392_out), .B(inst346_sum), .Cin(inst376_cout), .Sum(inst377_sum), .Cout(inst377_cout));
  FA inst408 (.A(inst425_out), .B(inst377_sum), .Cin(inst407_cout), .Sum(inst408_sum), .Cout(inst408_cout));
  FA inst439 (.A(inst458_out), .B(inst408_sum), .Cin(inst438_cout), .Sum(inst439_sum), .Cout(inst439_cout));
  FA inst470 (.A(inst491_out), .B(inst439_sum), .Cin(inst469_cout), .Sum(Product[20]), .Cout(inst470_cout));
  and inst161 (inst161_out, A[15], B[5]);
  and inst194 (inst194_out, A[14], B[6]);
  and inst227 (inst227_out, A[13], B[7]);
  and inst392 (inst392_out, A[8], B[12]);
  and inst425 (inst425_out, A[7], B[13]);
  and inst260 (inst260_out, A[12], B[8]);
  and inst293 (inst293_out, A[11], B[9]);
  and inst326 (inst326_out, A[10], B[10]);
  and inst359 (inst359_out, A[9], B[11]);
  and inst458 (inst458_out, A[6], B[14]);
  and inst491 (inst491_out, A[5], B[15]);
  FA inst128 (.A(inst129_out), .B(inst97_cout), .Cin(inst127_cout), .Sum(inst128_sum), .Cout(inst128_cout));
  FA inst159 (.A(inst162_out), .B(inst128_sum), .Cin(inst158_cout), .Sum(inst159_sum), .Cout(inst159_cout));
  FA inst190 (.A(inst195_out), .B(inst159_sum), .Cin(inst189_cout), .Sum(inst190_sum), .Cout(inst190_cout));
  FA inst221 (.A(inst228_out), .B(inst190_sum), .Cin(inst220_cout), .Sum(inst221_sum), .Cout(inst221_cout));
  FA inst252 (.A(inst261_out), .B(inst221_sum), .Cin(inst251_cout), .Sum(inst252_sum), .Cout(inst252_cout));
  FA inst283 (.A(inst294_out), .B(inst252_sum), .Cin(inst282_cout), .Sum(inst283_sum), .Cout(inst283_cout));
  FA inst314 (.A(inst327_out), .B(inst283_sum), .Cin(inst313_cout), .Sum(inst314_sum), .Cout(inst314_cout));
  FA inst345 (.A(inst360_out), .B(inst314_sum), .Cin(inst344_cout), .Sum(inst345_sum), .Cout(inst345_cout));
  FA inst376 (.A(inst393_out), .B(inst345_sum), .Cin(inst375_cout), .Sum(inst376_sum), .Cout(inst376_cout));
  FA inst407 (.A(inst426_out), .B(inst376_sum), .Cin(inst406_cout), .Sum(inst407_sum), .Cout(inst407_cout));
  FA inst438 (.A(inst459_out), .B(inst407_sum), .Cin(inst437_cout), .Sum(inst438_sum), .Cout(inst438_cout));
  FA inst469 (.A(inst492_out), .B(inst438_sum), .Cin(inst468_cout), .Sum(Product[19]), .Cout(inst469_cout));
  and inst162 (inst162_out, A[14], B[5]);
  and inst195 (inst195_out, A[13], B[6]);
  and inst129 (inst129_out, A[15], B[4]);
  and inst228 (inst228_out, A[12], B[7]);
  and inst261 (inst261_out, A[11], B[8]);
  and inst294 (inst294_out, A[10], B[9]);
  and inst327 (inst327_out, A[9], B[10]);
  and inst360 (inst360_out, A[8], B[11]);
  and inst393 (inst393_out, A[7], B[12]);
  and inst426 (inst426_out, A[6], B[13]);
  and inst459 (inst459_out, A[5], B[14]);
  and inst492 (inst492_out, A[4], B[15]);
  FA inst97 (.A(inst98_out), .B(inst65_cout), .Cin(inst96_cout), .Sum(inst97_sum), .Cout(inst97_cout));
  FA inst127 (.A(inst130_out), .B(inst97_sum), .Cin(inst126_cout), .Sum(inst127_sum), .Cout(inst127_cout));
  FA inst158 (.A(inst163_out), .B(inst127_sum), .Cin(inst157_cout), .Sum(inst158_sum), .Cout(inst158_cout));
  FA inst189 (.A(inst196_out), .B(inst158_sum), .Cin(inst188_cout), .Sum(inst189_sum), .Cout(inst189_cout));
  FA inst251 (.A(inst262_out), .B(inst220_sum), .Cin(inst250_cout), .Sum(inst251_sum), .Cout(inst251_cout));
  FA inst282 (.A(inst295_out), .B(inst251_sum), .Cin(inst281_cout), .Sum(inst282_sum), .Cout(inst282_cout));
  FA inst344 (.A(inst361_out), .B(inst313_sum), .Cin(inst343_cout), .Sum(inst344_sum), .Cout(inst344_cout));
  FA inst375 (.A(inst394_out), .B(inst344_sum), .Cin(inst374_cout), .Sum(inst375_sum), .Cout(inst375_cout));
  FA inst437 (.A(inst460_out), .B(inst406_sum), .Cin(inst436_cout), .Sum(inst437_sum), .Cout(inst437_cout));
  FA inst468 (.A(inst493_out), .B(inst437_sum), .Cin(inst467_cout), .Sum(Product[18]), .Cout(inst468_cout));
  FA inst220 (.A(inst229_out), .B(inst189_sum), .Cin(inst219_cout), .Sum(inst220_sum), .Cout(inst220_cout));
  FA inst313 (.A(inst328_out), .B(inst282_sum), .Cin(inst312_cout), .Sum(inst313_sum), .Cout(inst313_cout));
  FA inst406 (.A(inst427_out), .B(inst375_sum), .Cin(inst405_cout), .Sum(inst406_sum), .Cout(inst406_cout));
  and inst98 (inst98_out, A[15], B[3]);
  and inst130 (inst130_out, A[14], B[4]);
  and inst163 (inst163_out, A[13], B[5]);
  and inst196 (inst196_out, A[12], B[6]);
  and inst229 (inst229_out, A[11], B[7]);
  and inst262 (inst262_out, A[10], B[8]);
  and inst295 (inst295_out, A[9], B[9]);
  and inst328 (inst328_out, A[8], B[10]);
  and inst361 (inst361_out, A[7], B[11]);
  and inst394 (inst394_out, A[6], B[12]);
  and inst427 (inst427_out, A[5], B[13]);
  and inst460 (inst460_out, A[4], B[14]);
  and inst493 (inst493_out, A[3], B[15]);
  FA inst65 (.A(inst66_out), .B(inst49_carry), .Cin(inst64_cout), .Sum(inst65_sum), .Cout(inst65_cout));
  FA inst96 (.A(inst900_out), .B(inst65_sum), .Cin(inst95_cout), .Sum(inst96_sum), .Cout(inst96_cout));
  FA inst126 (.A(inst131_out), .B(inst96_sum), .Cin(inst125_cout), .Sum(inst126_sum), .Cout(inst126_cout));
  FA inst157 (.A(inst164_out), .B(inst126_sum), .Cin(inst156_cout), .Sum(inst157_sum), .Cout(inst157_cout));
  FA inst188 (.A(inst197_out), .B(inst157_sum), .Cin(inst187_cout), .Sum(inst188_sum), .Cout(inst188_cout));
  FA inst219 (.A(inst230_out), .B(inst188_sum), .Cin(inst218_cout), .Sum(inst219_sum), .Cout(inst219_cout));
  FA inst250 (.A(inst263_out), .B(inst219_sum), .Cin(inst249_cout), .Sum(inst250_sum), .Cout(inst250_cout));
  FA inst281 (.A(inst296_out), .B(inst250_sum), .Cin(inst280_cout), .Sum(inst281_sum), .Cout(inst281_cout));
  FA inst312 (.A(inst329_out), .B(inst281_sum), .Cin(inst311_cout), .Sum(inst312_sum), .Cout(inst312_cout));
  FA inst343 (.A(inst362_out), .B(inst312_sum), .Cin(inst342_cout), .Sum(inst343_sum), .Cout(inst343_cout));
  FA inst374 (.A(inst395_out), .B(inst343_sum), .Cin(inst373_cout), .Sum(inst374_sum), .Cout(inst374_cout));
  FA inst405 (.A(inst428_out), .B(inst374_sum), .Cin(inst404_cout), .Sum(inst405_sum), .Cout(inst405_cout));
  FA inst436 (.A(inst461_out), .B(inst405_sum), .Cin(inst435_cout), .Sum(inst436_sum), .Cout(inst436_cout));
  FA inst467 (.A(inst494_out), .B(inst436_sum), .Cin(inst466_cout), .Sum(Product[17]), .Cout(inst467_cout));
  and inst66 (inst66_out, A[15], B[2]);
  and inst900 (inst900_out, A[14], B[3]);
  and inst131 (inst131_out, A[13], B[4]);
  and inst164 (inst164_out, A[12], B[5]);
  and inst197 (inst197_out, A[11], B[6]);
  and inst230 (inst230_out, A[10], B[7]);
  and inst263 (inst263_out, A[9], B[8]);
  and inst296 (inst296_out, A[8], B[9]);
  and inst329 (inst329_out, A[7], B[10]);
  and inst362 (inst362_out, A[6], B[11]);
  and inst395 (inst395_out, A[5], B[12]);
  and inst428 (inst428_out, A[4], B[13]);
  and inst461 (inst461_out, A[3], B[14]);
  and inst494 (inst494_out, A[2], B[15]);
  HA inst49 (.A(An1_15), .B(inst48_cout), .Sum(inst49_sum), .Carry(inst49_carry));
  FA inst64 (.A(inst67_out), .B(inst49_sum), .Cin(inst63_cout), .Sum(inst64_sum), .Cout(inst64_cout));
  FA inst95 (.A(inst100_out), .B(inst64_sum), .Cin(inst94_cout), .Sum(inst95_sum), .Cout(inst95_cout));
  FA inst125 (.A(inst132_out), .B(inst95_sum), .Cin(inst124_cout), .Sum(inst125_sum), .Cout(inst125_cout));
  FA inst156 (.A(inst165_out), .B(inst125_sum), .Cin(inst155_cout), .Sum(inst156_sum), .Cout(inst156_cout));
  FA inst187 (.A(inst198_out), .B(inst156_sum), .Cin(inst186_cout), .Sum(inst187_sum), .Cout(inst187_cout));
  FA inst218 (.A(inst231_out), .B(inst187_sum), .Cin(inst217_cout), .Sum(inst218_sum), .Cout(inst218_cout));
  FA inst249 (.A(inst264_out), .B(inst218_sum), .Cin(inst248_cout), .Sum(inst249_sum), .Cout(inst249_cout));
  FA inst280 (.A(inst297_out), .B(inst249_sum), .Cin(inst279_cout), .Sum(inst280_sum), .Cout(inst280_cout));
  FA inst311 (.A(inst330_out), .B(inst280_sum), .Cin(inst310_cout), .Sum(inst311_sum), .Cout(inst311_cout));
  FA inst342 (.A(inst363_out), .B(inst311_sum), .Cin(inst341_cout), .Sum(inst342_sum), .Cout(inst342_cout));
  FA inst373 (.A(inst396_out), .B(inst342_sum), .Cin(inst372_cout), .Sum(inst373_sum), .Cout(inst373_cout));
  FA inst404 (.A(inst429_out), .B(inst373_sum), .Cin(inst403_cout), .Sum(inst404_sum), .Cout(inst404_cout));
  FA inst435 (.A(inst462_out), .B(inst404_sum), .Cin(inst434_cout), .Sum(inst435_sum), .Cout(inst435_cout));
  FA inst466 (.A(inst495_out), .B(inst435_sum), .Cin(inst465_carry), .Sum(Product[16]), .Cout(inst466_cout));
  and inst67 (inst67_out, A[14], B[2]);
  and inst100 (inst100_out, A[13], B[3]);
  and inst264 (inst264_out, A[8], B[8]);
  and inst297 (inst297_out, A[7], B[9]);
  and inst495 (inst495_out, A[1], B[15]);
  and inst132 (inst132_out, A[12], B[4]);
  and inst165 (inst165_out, A[11], B[5]);
  and inst198 (inst198_out, A[10], B[6]);
  and inst231 (inst231_out, A[9], B[7]);
  and inst330 (inst330_out, A[6], B[10]);
  and inst363 (inst363_out, A[5], B[11]);
  and inst396 (inst396_out, A[4], B[12]);
  and inst429 (inst429_out, A[3], B[13]);
  and inst462 (inst462_out, A[2], B[14]);
  FA inst48 (.A(An0_15), .B(An1_14), .Cin(inst47_cout), .Sum(inst48_sum), .Cout(inst48_cout));
  FA inst63 (.A(inst68_out), .B(inst48_sum), .Cin(inst62_cout), .Sum(inst63_sum), .Cout(inst63_cout));
  FA inst94 (.A(inst101_out), .B(inst63_sum), .Cin(inst93_cout), .Sum(inst94_sum), .Cout(inst94_cout));
  FA inst124 (.A(inst133_out), .B(inst94_sum), .Cin(inst123_cout), .Sum(inst124_sum), .Cout(inst124_cout));
  FA inst155 (.A(inst166_out), .B(inst124_sum), .Cin(inst154_cout), .Sum(inst155_sum), .Cout(inst155_cout));
  FA inst186 (.A(inst199_out), .B(inst155_sum), .Cin(inst185_cout), .Sum(inst186_sum), .Cout(inst186_cout));
  FA inst217 (.A(inst232_out), .B(inst186_sum), .Cin(inst216_cout), .Sum(inst217_sum), .Cout(inst217_cout));
  FA inst248 (.A(inst265_out), .B(inst217_sum), .Cin(inst247_cout), .Sum(inst248_sum), .Cout(inst248_cout));
  FA inst279 (.A(inst298_out), .B(inst248_sum), .Cin(inst278_cout), .Sum(inst279_sum), .Cout(inst279_cout));
  FA inst310 (.A(inst331_out), .B(inst279_sum), .Cin(inst309_cout), .Sum(inst310_sum), .Cout(inst310_cout));
  FA inst341 (.A(inst364_out), .B(inst310_sum), .Cin(inst340_cout), .Sum(inst341_sum), .Cout(inst341_cout));
  FA inst372 (.A(inst397_out), .B(inst341_sum), .Cin(inst371_cout), .Sum(inst372_sum), .Cout(inst372_cout));
  FA inst403 (.A(inst430_out), .B(inst372_sum), .Cin(inst402_cout), .Sum(inst403_sum), .Cout(inst403_cout));
  FA inst434 (.A(inst463_out), .B(inst403_sum), .Cin(inst433_carry), .Sum(inst434_sum), .Cout(inst434_cout));
  HA inst465 (.A(inst496_out), .B(inst434_sum), .Sum(Product[15]), .Carry(inst465_carry));
  and inst68 (inst68_out, A[13], B[2]);
  and inst101 (inst101_out, A[12], B[3]);
  and inst133 (inst133_out, A[11], B[4]);
  and inst166 (inst166_out, A[10], B[5]);
  and inst199 (inst199_out, A[9], B[6]);
  and inst232 (inst232_out, A[8], B[7]);
  and inst265 (inst265_out, A[7], B[8]);
  and inst298 (inst298_out, A[6], B[9]);
  and inst331 (inst331_out, A[5], B[10]);
  and inst364 (inst364_out, A[4], B[11]);
  and inst397 (inst397_out, A[3], B[12]);
  and inst430 (inst430_out, A[2], B[13]);
  and inst463 (inst463_out, A[1], B[14]);
  and inst496 (inst496_out, A[0], B[15]);
  FA inst47 (.A(An0_14), .B(An1_13), .Cin(inst46_cout), .Sum(inst47_sum), .Cout(inst47_cout));
  FA inst62 (.A(inst69_out), .B(inst47_sum), .Cin(inst61_cout), .Sum(inst62_sum), .Cout(inst62_cout));
  FA inst123 (.A(inst134_out), .B(inst93_sum), .Cin(inst122_cout), .Sum(inst123_sum), .Cout(inst123_cout));
  FA inst154 (.A(inst167_out), .B(inst123_sum), .Cin(inst153_cout), .Sum(inst154_sum), .Cout(inst154_cout));
  FA inst216 (.A(inst233_out), .B(inst185_sum), .Cin(inst215_cout), .Sum(inst216_sum), .Cout(inst216_cout));
  FA inst247 (.A(inst266_out), .B(inst216_sum), .Cin(inst246_cout), .Sum(inst247_sum), .Cout(inst247_cout));
  FA inst309 (.A(inst332_out), .B(inst278_sum), .Cin(inst308_cout), .Sum(inst309_sum), .Cout(inst309_cout));
  FA inst340 (.A(inst365_out), .B(inst309_sum), .Cin(inst339_cout), .Sum(inst340_sum), .Cout(inst340_cout));
  FA inst402 (.A(inst431_out), .B(inst371_sum), .Cin(inst401_carry), .Sum(inst402_sum), .Cout(inst402_cout));
  HA inst433 (.A(inst464_out), .B(inst402_sum), .Sum(Product[14]), .Carry(inst433_carry));
  FA inst93 (.A(inst102_out), .B(inst62_sum), .Cin(inst92_cout), .Sum(inst93_sum), .Cout(inst93_cout));
  FA inst185 (.A(inst200_out), .B(inst154_sum), .Cin(inst184_cout), .Sum(inst185_sum), .Cout(inst185_cout));
  FA inst278 (.A(inst299_out), .B(inst247_sum), .Cin(inst277_cout), .Sum(inst278_sum), .Cout(inst278_cout));
  FA inst371 (.A(inst398_out), .B(inst340_sum), .Cin(inst370_cout), .Sum(inst371_sum), .Cout(inst371_cout));
  and inst69 (inst69_out, A[12], B[2]);
  and inst102 (inst102_out, A[11], B[3]);
  and inst134 (inst134_out, A[10], B[4]);
  and inst167 (inst167_out, A[9], B[5]);
  and inst200 (inst200_out, A[8], B[6]);
  and inst233 (inst233_out, A[7], B[7]);
  and inst266 (inst266_out, A[6], B[8]);
  and inst299 (inst299_out, A[5], B[9]);
  and inst332 (inst332_out, A[4], B[10]);
  and inst365 (inst365_out, A[3], B[11]);
  and inst398 (inst398_out, A[2], B[12]);
  and inst431 (inst431_out, A[1], B[13]);
  and inst464 (inst464_out, A[0], B[14]);
  FA inst46 (.A(An0_13), .B(An1_12), .Cin(inst45_cout), .Sum(inst46_sum), .Cout(inst46_cout));
  FA inst61 (.A(inst70_out), .B(inst46_sum), .Cin(inst60_cout), .Sum(inst61_sum), .Cout(inst61_cout));
  FA inst92 (.A(inst103_out), .B(inst61_sum), .Cin(inst91_cout), .Sum(inst92_sum), .Cout(inst92_cout));
  FA inst122 (.A(inst135_out), .B(inst92_sum), .Cin(inst121_cout), .Sum(inst122_sum), .Cout(inst122_cout));
  FA inst153 (.A(inst168_out), .B(inst122_sum), .Cin(inst152_cout), .Sum(inst153_sum), .Cout(inst153_cout));
  FA inst184 (.A(inst201_out), .B(inst153_sum), .Cin(inst183_cout), .Sum(inst184_sum), .Cout(inst184_cout));
  FA inst215 (.A(inst234_out), .B(inst184_sum), .Cin(inst214_cout), .Sum(inst215_sum), .Cout(inst215_cout));
  FA inst246 (.A(inst267_out), .B(inst215_sum), .Cin(inst245_cout), .Sum(inst246_sum), .Cout(inst246_cout));
  FA inst277 (.A(inst300_out), .B(inst246_sum), .Cin(inst276_cout), .Sum(inst277_sum), .Cout(inst277_cout));
  FA inst308 (.A(inst333_out), .B(inst277_sum), .Cin(inst307_cout), .Sum(inst308_sum), .Cout(inst308_cout));
  FA inst339 (.A(inst366_out), .B(inst308_sum), .Cin(inst338_cout), .Sum(inst339_sum), .Cout(inst339_cout));
  FA inst370 (.A(inst399_out), .B(inst339_sum), .Cin(inst369_carry), .Sum(inst370_sum), .Cout(inst370_cout));
  HA inst401 (.A(inst432_out), .B(inst370_sum), .Sum(Product[13]), .Carry(inst401_carry));
  and inst70 (inst70_out, A[11], B[2]);
  and inst103 (inst103_out, A[10], B[3]);
  and inst135 (inst135_out, A[9], B[4]);
  and inst168 (inst168_out, A[8], B[5]);
  and inst201 (inst201_out, A[7], B[6]);
  and inst234 (inst234_out, A[6], B[7]);
  and inst267 (inst267_out, A[5], B[8]);
  and inst300 (inst300_out, A[4], B[9]);
  and inst333 (inst333_out, A[3], B[10]);
  and inst366 (inst366_out, A[2], B[11]);
  and inst399 (inst399_out, A[1], B[12]);
  and inst432 (inst432_out, A[0], B[13]);
  FA inst45 (.A(An0_12), .B(An1_11), .Cin(inst44_cout), .Sum(inst45_sum), .Cout(inst45_cout));
  FA inst60 (.A(inst71_out), .B(inst45_sum), .Cin(inst59_cout), .Sum(inst60_sum), .Cout(inst60_cout));
  FA inst91 (.A(inst104_out), .B(inst60_sum), .Cin(inst90_cout), .Sum(inst91_sum), .Cout(inst91_cout));
  FA inst121 (.A(inst136_out), .B(inst91_sum), .Cin(inst120_cout), .Sum(inst121_sum), .Cout(inst121_cout));
  FA inst152 (.A(inst169_out), .B(inst121_sum), .Cin(inst151_cout), .Sum(inst152_sum), .Cout(inst152_cout));
  FA inst183 (.A(inst202_out), .B(inst152_sum), .Cin(inst182_cout), .Sum(inst183_sum), .Cout(inst183_cout));
  FA inst214 (.A(inst235_out), .B(inst183_sum), .Cin(inst213_cout), .Sum(inst214_sum), .Cout(inst214_cout));
  FA inst245 (.A(inst268_out), .B(inst214_sum), .Cin(inst244_cout), .Sum(inst245_sum), .Cout(inst245_cout));
  FA inst276 (.A(inst301_out), .B(inst245_sum), .Cin(inst275_cout), .Sum(inst276_sum), .Cout(inst276_cout));
  FA inst307 (.A(inst334_out), .B(inst276_sum), .Cin(inst306_cout), .Sum(inst307_sum), .Cout(inst307_cout));
  FA inst338 (.A(inst367_out), .B(inst307_sum), .Cin(inst337_carry), .Sum(inst338_sum), .Cout(inst338_cout));
  HA inst369 (.A(inst400_out), .B(inst338_sum), .Sum(Product[12]), .Carry(inst369_carry));
  and inst136 (inst136_out, A[8], B[4]);
  and inst169 (inst169_out, A[7], B[5]);
  and inst367 (inst367_out, A[1], B[11]);
  and inst71 (inst71_out, A[10], B[2]);
  and inst104 (inst104_out, A[9], B[3]);
  and inst202 (inst202_out, A[6], B[6]);
  and inst235 (inst235_out, A[5], B[7]);
  and inst268 (inst268_out, A[4], B[8]);
  and inst301 (inst301_out, A[3], B[9]);
  and inst334 (inst334_out, A[2], B[10]);
  and inst400 (inst400_out, A[0], B[12]);
  FA inst44 (.A(An0_11), .B(An1_10), .Cin(inst43_cout), .Sum(inst44_sum), .Cout(inst44_cout));
  FA inst59 (.A(inst72_out), .B(inst44_sum), .Cin(inst58_cout), .Sum(inst59_sum), .Cout(inst59_cout));
  FA inst90 (.A(inst105_out), .B(inst59_sum), .Cin(inst89_cout), .Sum(inst90_sum), .Cout(inst90_cout));
  FA inst120 (.A(inst137_out), .B(inst90_sum), .Cin(inst119_cout), .Sum(inst120_sum), .Cout(inst120_cout));
  FA inst151 (.A(inst170_out), .B(inst120_sum), .Cin(inst150_cout), .Sum(inst151_sum), .Cout(inst151_cout));
  FA inst182 (.A(inst203_out), .B(inst151_sum), .Cin(inst181_cout), .Sum(inst182_sum), .Cout(inst182_cout));
  FA inst213 (.A(inst236_out), .B(inst182_sum), .Cin(inst212_cout), .Sum(inst213_sum), .Cout(inst213_cout));
  FA inst244 (.A(inst269_out), .B(inst213_sum), .Cin(inst243_cout), .Sum(inst244_sum), .Cout(inst244_cout));
  FA inst275 (.A(inst302_out), .B(inst244_sum), .Cin(inst274_cout), .Sum(inst275_sum), .Cout(inst275_cout));
  FA inst306 (.A(inst335_out), .B(inst275_sum), .Cin(inst305_carry), .Sum(inst306_sum), .Cout(inst306_cout));
  HA inst337 (.A(inst368_out), .B(inst306_sum), .Sum(Product[11]), .Carry(inst337_carry));
  and inst72 (inst72_out, A[9], B[2]);
  and inst105 (inst105_out, A[8], B[3]);
  and inst137 (inst137_out, A[7], B[4]);
  and inst170 (inst170_out, A[6], B[5]);
  and inst203 (inst203_out, A[5], B[6]);
  and inst236 (inst236_out, A[4], B[7]);
  and inst269 (inst269_out, A[3], B[8]);
  and inst302 (inst302_out, A[2], B[9]);
  and inst335 (inst335_out, A[1], B[10]);
  and inst368 (inst368_out, A[0], B[11]);
  FA inst43 (.A(An0_10), .B(An1_9), .Cin(inst42_cout), .Sum(inst43_sum), .Cout(inst43_cout));
  FA inst89 (.A(inst106_out), .B(inst58_sum), .Cin(inst88_cout), .Sum(inst89_sum), .Cout(inst89_cout));
  FA inst119 (.A(inst138_out), .B(inst89_sum), .Cin(inst118_cout), .Sum(inst119_sum), .Cout(inst119_cout));
  FA inst181 (.A(inst204_out), .B(inst150_sum), .Cin(inst180_cout), .Sum(inst181_sum), .Cout(inst181_cout));
  FA inst212 (.A(inst237_out), .B(inst181_sum), .Cin(inst211_cout), .Sum(inst212_sum), .Cout(inst212_cout));
  FA inst274 (.A(inst303_out), .B(inst243_sum), .Cin(inst273_carry), .Sum(inst274_sum), .Cout(inst274_cout));
  HA inst305 (.A(inst336_out), .B(inst274_sum), .Sum(Product[10]), .Carry(inst305_carry));
  FA inst58 (.A(inst73_out), .B(inst43_sum), .Cin(inst57_cout), .Sum(inst58_sum), .Cout(inst58_cout));
  FA inst150 (.A(inst171_out), .B(inst119_sum), .Cin(inst149_cout), .Sum(inst150_sum), .Cout(inst150_cout));
  FA inst243 (.A(inst270_out), .B(inst212_sum), .Cin(inst242_cout), .Sum(inst243_sum), .Cout(inst243_cout));
  and inst73 (inst73_out, A[8], B[2]);
  and inst106 (inst106_out, A[7], B[3]);
  and inst138 (inst138_out, A[6], B[4]);
  and inst171 (inst171_out, A[5], B[5]);
  and inst204 (inst204_out, A[4], B[6]);
  and inst237 (inst237_out, A[3], B[7]);
  and inst270 (inst270_out, A[2], B[8]);
  and inst303 (inst303_out, A[1], B[9]);
  and inst336 (inst336_out, A[0], B[10]);
  FA inst42 (.A(An0_9), .B(An1_8), .Cin(inst41_cout), .Sum(inst42_sum), .Cout(inst42_cout));
  FA inst57 (.A(inst74_out), .B(inst42_sum), .Cin(inst56_cout), .Sum(inst57_sum), .Cout(inst57_cout));
  FA inst88 (.A(inst107_out), .B(inst57_sum), .Cin(inst87_cout), .Sum(inst88_sum), .Cout(inst88_cout));
  FA inst118 (.A(inst139_out), .B(inst88_sum), .Cin(inst117_cout), .Sum(inst118_sum), .Cout(inst118_cout));
  FA inst149 (.A(inst172_out), .B(inst118_sum), .Cin(inst148_cout), .Sum(inst149_sum), .Cout(inst149_cout));
  FA inst180 (.A(inst205_out), .B(inst149_sum), .Cin(inst179_cout), .Sum(inst180_sum), .Cout(inst180_cout));
  FA inst211 (.A(inst238_out), .B(inst180_sum), .Cin(inst210_cout), .Sum(inst211_sum), .Cout(inst211_cout));
  FA inst242 (.A(inst271_out), .B(inst211_sum), .Cin(inst241_carry), .Sum(inst242_sum), .Cout(inst242_cout));
  HA inst273 (.A(inst304_out), .B(inst242_sum), .Sum(Product[9]), .Carry(inst273_carry));
  and inst74 (inst74_out, A[7], B[2]);
  and inst107 (inst107_out, A[6], B[3]);
  and inst139 (inst139_out, A[5], B[4]);
  and inst172 (inst172_out, A[4], B[5]);
  and inst205 (inst205_out, A[3], B[6]);
  and inst238 (inst238_out, A[2], B[7]);
  and inst271 (inst271_out, A[1], B[8]);
  and inst304 (inst304_out, A[0], B[9]);
  FA inst41 (.A(An0_8), .B(An1_7), .Cin(inst40_cout), .Sum(inst41_sum), .Cout(inst41_cout));
  FA inst56 (.A(inst75_out), .B(inst41_sum), .Cin(inst55_cout), .Sum(inst56_sum), .Cout(inst56_cout));
  FA inst87 (.A(inst108_out), .B(inst56_sum), .Cin(inst86_cout), .Sum(inst87_sum), .Cout(inst87_cout));
  FA inst117 (.A(inst140_out), .B(inst87_sum), .Cin(inst116_cout), .Sum(inst117_sum), .Cout(inst117_cout));
  FA inst148 (.A(inst173_out), .B(inst117_sum), .Cin(inst147_cout), .Sum(inst148_sum), .Cout(inst148_cout));
  FA inst179 (.A(inst206_out), .B(inst148_sum), .Cin(inst178_cout), .Sum(inst179_sum), .Cout(inst179_cout));
  FA inst210 (.A(inst239_out), .B(inst179_sum), .Cin(inst209_carry), .Sum(inst210_sum), .Cout(inst210_cout));
  HA inst241 (.A(inst272_out), .B(inst210_sum), .Sum(Product[8]), .Carry(inst241_carry));
  and inst239 (inst239_out, A[1], B[7]);
  and inst75 (inst75_out, A[6], B[2]);
  and inst108 (inst108_out, A[5], B[3]);
  and inst140 (inst140_out, A[4], B[4]);
  and inst173 (inst173_out, A[3], B[5]);
  and inst206 (inst206_out, A[2], B[6]);
  and inst272 (inst272_out, A[0], B[8]);
  FA inst40 (.A(An0_7), .B(An1_6), .Cin(inst39_cout), .Sum(inst40_sum), .Cout(inst40_cout));
  FA inst55 (.A(inst76_out), .B(inst40_sum), .Cin(inst54_cout), .Sum(inst55_sum), .Cout(inst55_cout));
  FA inst86 (.A(inst109_out), .B(inst55_sum), .Cin(inst85_cout), .Sum(inst86_sum), .Cout(inst86_cout));
  FA inst116 (.A(inst141_out), .B(inst86_sum), .Cin(inst115_cout), .Sum(inst116_sum), .Cout(inst116_cout));
  FA inst147 (.A(inst174_out), .B(inst116_sum), .Cin(inst146_cout), .Sum(inst147_sum), .Cout(inst147_cout));
  FA inst178 (.A(inst207_out), .B(inst147_sum), .Cin(inst177_carry), .Sum(inst178_sum), .Cout(inst178_cout));
  HA inst209 (.A(inst240_out), .B(inst178_sum), .Sum(Product[7]), .Carry(inst209_carry));
  and inst76 (inst76_out, A[5], B[2]);
  and inst109 (inst109_out, A[4], B[3]);
  and inst141 (inst141_out, A[3], B[4]);
  and inst174 (inst174_out, A[2], B[5]);
  and inst207 (inst207_out, A[1], B[6]);
  and inst240 (inst240_out, A[0], B[7]);
  FA inst54 (.A(inst77_out), .B(inst39_sum), .Cin(inst53_cout), .Sum(inst54_sum), .Cout(inst54_cout));
  FA inst85 (.A(inst110_out), .B(inst54_sum), .Cin(inst84_cout), .Sum(inst85_sum), .Cout(inst85_cout));
  FA inst146 (.A(inst175_out), .B(inst115_sum), .Cin(inst145_carry), .Sum(inst146_sum), .Cout(inst146_cout));
  HA inst177 (.A(inst208_out), .B(inst146_sum), .Sum(Product[6]), .Carry(inst177_carry));
  FA inst39 (.A(An0_6), .B(An1_5), .Cin(inst38_cout), .Sum(inst39_sum), .Cout(inst39_cout));
  FA inst115 (.A(inst142_out), .B(inst85_sum), .Cin(inst114_cout), .Sum(inst115_sum), .Cout(inst115_cout));
  and inst77 (inst77_out, A[4], B[2]);
  and inst110 (inst110_out, A[3], B[3]);
  and inst142 (inst142_out, A[2], B[4]);
  and inst175 (inst175_out, A[1], B[5]);
  and inst208 (inst208_out, A[0], B[6]);
  FA inst38 (.A(An0_5), .B(An1_4), .Cin(inst37_cout), .Sum(inst38_sum), .Cout(inst38_cout));
  FA inst53 (.A(inst78_out), .B(inst38_sum), .Cin(inst52_cout), .Sum(inst53_sum), .Cout(inst53_cout));
  FA inst84 (.A(inst111_out), .B(inst53_sum), .Cin(inst83_cout), .Sum(inst84_sum), .Cout(inst84_cout));
  FA inst114 (.A(inst143_out), .B(inst84_sum), .Cin(inst99_carry), .Sum(inst114_sum), .Cout(inst114_cout));
  HA inst145 (.A(inst176_out), .B(inst114_sum), .Sum(Product[5]), .Carry(inst145_carry));
  and inst78 (inst78_out, A[3], B[2]);
  and inst111 (inst111_out, A[2], B[3]);
  and inst143 (inst143_out, A[1], B[4]);
  and inst176 (inst176_out, A[0], B[5]);
  FA inst37 (.A(An0_4), .B(An1_3), .Cin(inst36_cout), .Sum(inst37_sum), .Cout(inst37_cout));
  FA inst52 (.A(inst79_out), .B(inst37_sum), .Cin(inst51_cout), .Sum(inst52_sum), .Cout(inst52_cout));
  FA inst83 (.A(inst112_out), .B(inst52_sum), .Cin(inst82_carry), .Sum(inst83_sum), .Cout(inst83_cout));
  HA inst99 (.A(inst144_out), .B(inst83_sum), .Sum(Product[4]), .Carry(inst99_carry));
  and inst112 (inst112_out, A[1], B[3]);
  and inst79 (inst79_out, A[2], B[2]);
  and inst144 (inst144_out, A[0], B[4]);
  FA inst36 (.A(An0_3), .B(An1_2), .Cin(inst35_cout), .Sum(inst36_sum), .Cout(inst36_cout));
  FA inst51 (.A(inst80_out), .B(inst36_sum), .Cin(inst50_carry), .Sum(inst51_sum), .Cout(inst51_cout));
  HA inst82 (.A(inst113_out), .B(inst51_sum), .Sum(Product[3]), .Carry(inst82_carry));
  and inst80 (inst80_out, A[1], B[2]);
  and inst113 (inst113_out, A[0], B[3]);
  FA inst35 (.A(An0_2), .B(An1_1), .Cin(inst34_carry), .Sum(inst35_sum), .Cout(inst35_cout));
  HA inst50 (.A(inst81_out), .B(inst35_sum), .Sum(Product[2]), .Carry(inst50_carry));
  and inst81 (inst81_out, A[0], B[2]);
  HA inst34 (.A(An0_1), .B(An1_0), .Sum(Product[1]), .Carry(inst34_carry));

  // Other names for the same wires on the sheet: p[31:0] = Product; p0 = Product[0]; p1 = Product[1]; p2 = Product[2];
  //   p3 = Product[3]; p4 = Product[4]; p5 = Product[5]; p6 = Product[6]; p7 = Product[7]; p8 = Product[8];
  //   p9 = Product[9]; p10 = Product[10]; p11 = Product[11]; p12 = Product[12]; p13 = Product[13]; p14 = Product[14];
  //   p15 = Product[15]; p16 = Product[16]; p17 = Product[17]; p18 = Product[18]; p19 = Product[19];
  //   p20 = Product[20]; p21 = Product[21]; p22 = Product[22]; p23 = Product[23]; p24 = Product[24];
  //   p25 = Product[25]; p26 = Product[26]; p27 = Product[27]; p28 = Product[28]; p29 = Product[29];
  //   p30 = Product[30]; p31 = Product[31]
endmodule
